# Altium project STM32F407_PLC_20260104.PrjPcb (part 1 of 2)
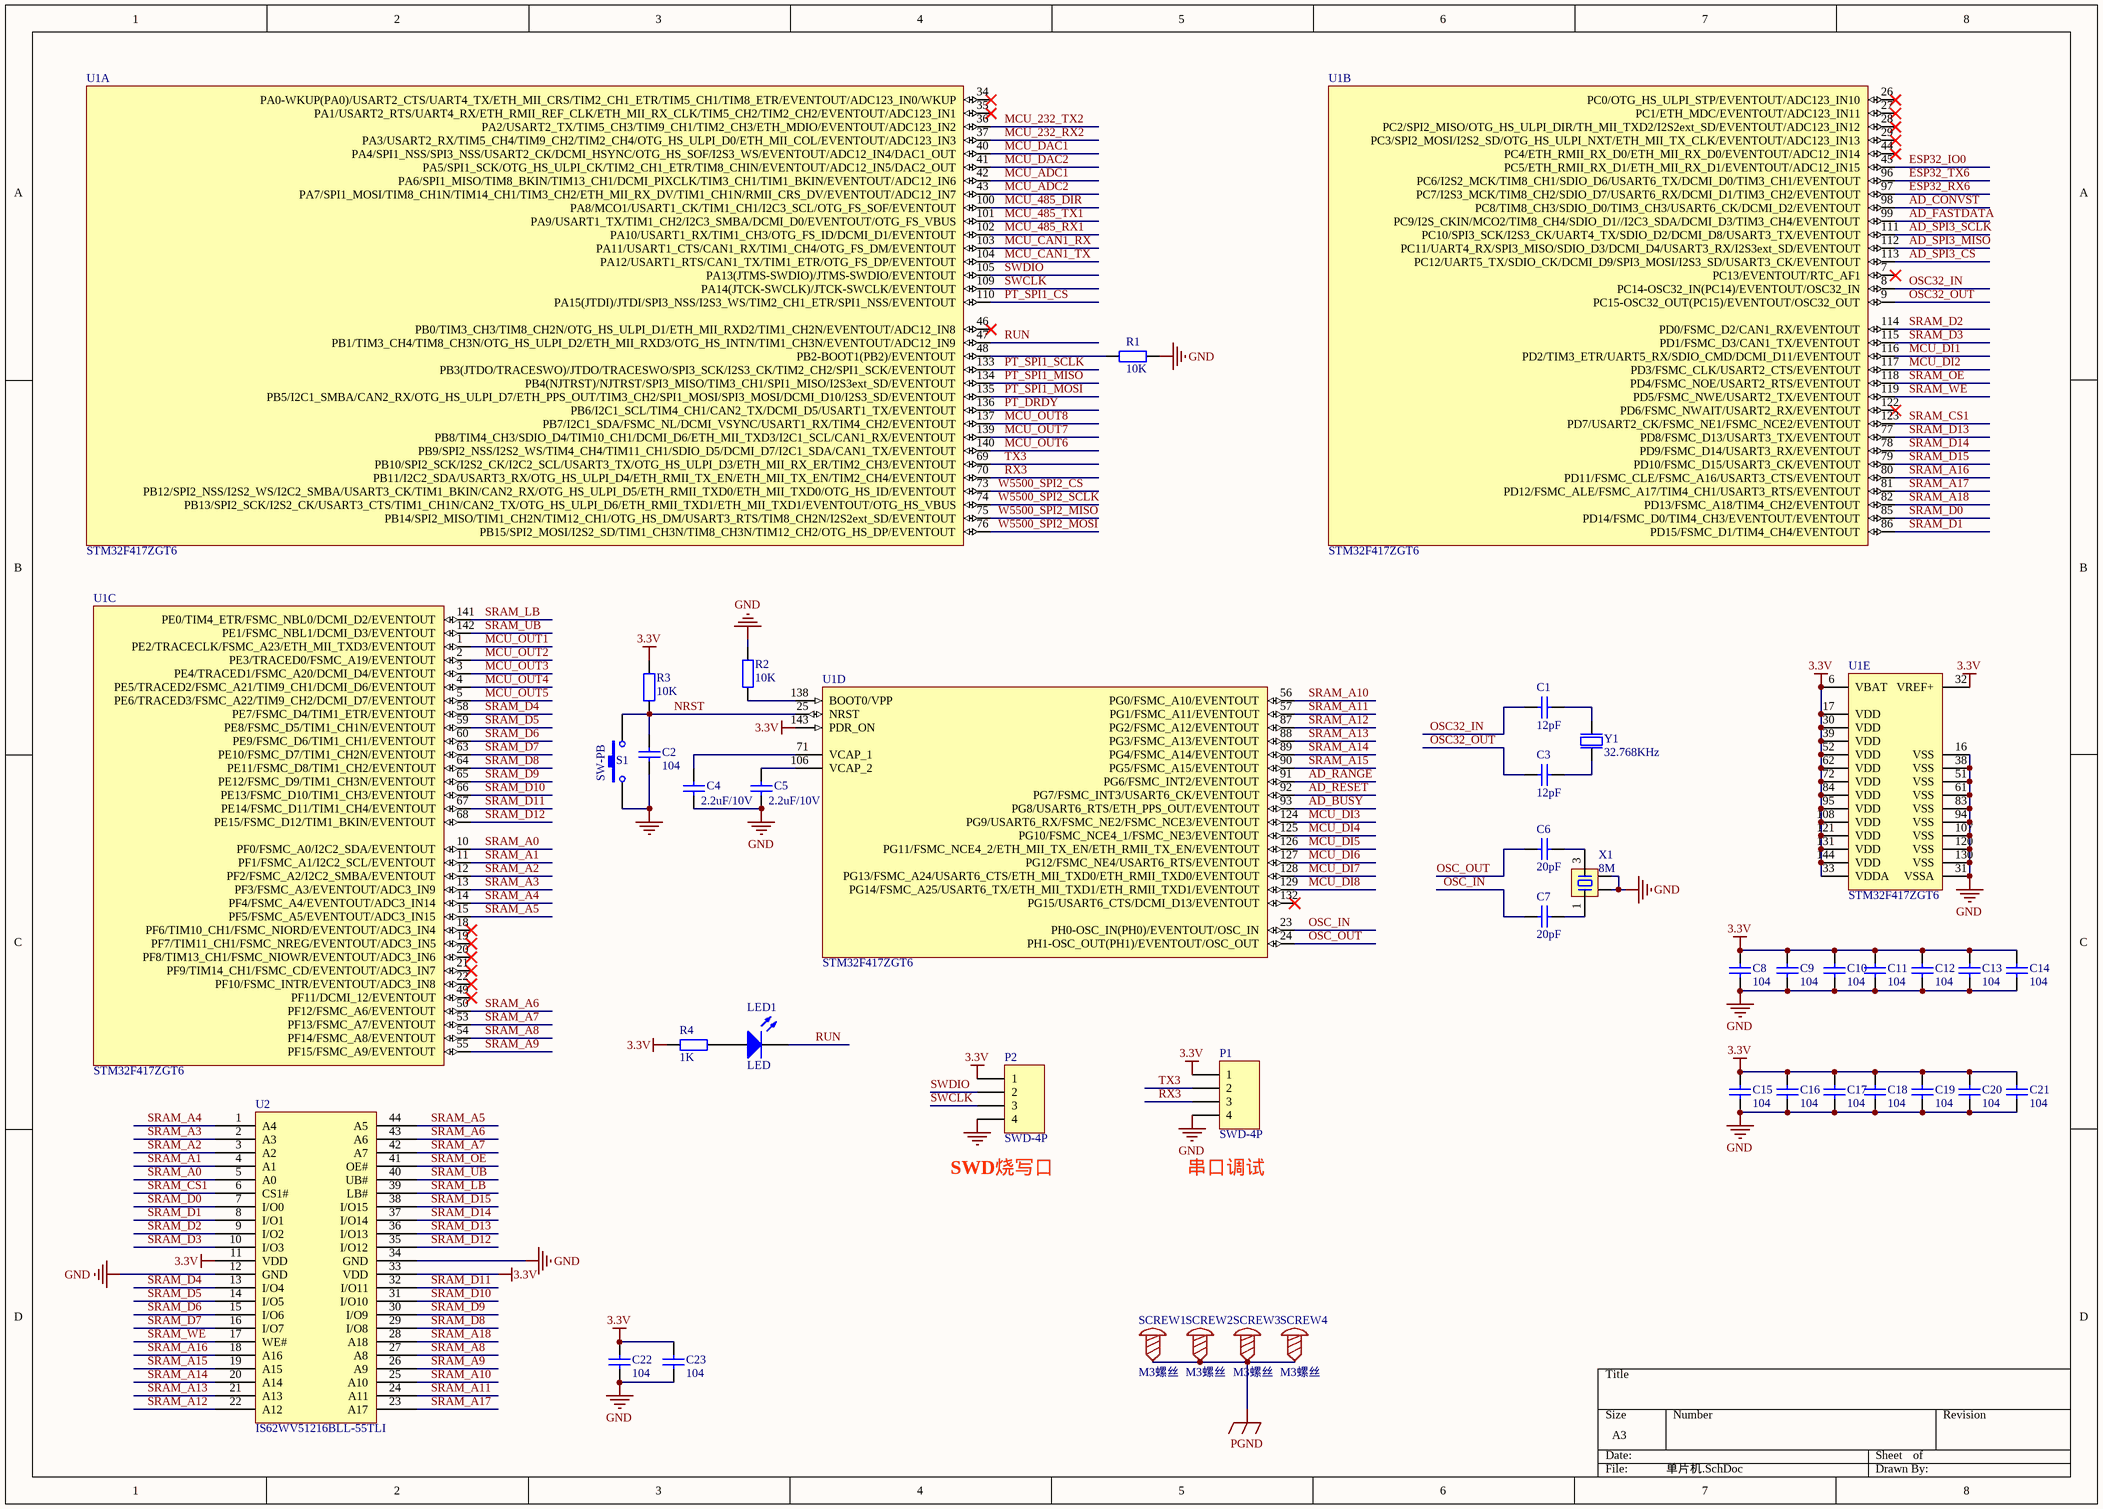
[diagram p0: 单片机.SchDoc]
8 sheets, 323 parts. Net scope: global (net labels, ports and power ports of the same name join across sheets).
Board file: STM32F407_PLC_20260104.PcbDoc
Sheets:
  单片机.SchDoc
  电源.SchDoc
  光耦开关量输入输出.SchDoc
  串口通信电路.SchDoc
  模拟量输入输出电路.SchDoc
  模拟量采集电路.SchDoc
  网络通信电路.SchDoc
  网表.SchDoc

## Sheet 单片机.SchDoc
size A3; SheetNumber: 1; SheetTotal: 7

### Parts
C1  12pF  [C 0603_L]
C2  104  [C 0603_L]
C3  12pF  [C 0603_L]
C4  2.2uF/10V  [C 0603_L]
C5  2.2uF/10V  [C 0603_L]
C6  20pF  [C 0603_L]
C7  20pF  [C 0603_L]
C8  104  [C 0603_L]
C9  104  [C 0603_L]
C10  104  [C 0603_L]
C11  104  [C 0603_L]
C12  104  [C 0603_L]
C13  104  [C 0603_L]
C14  104  [C 0603_L]
C15  104  [C 0603_L]
C16  104  [C 0603_L]
C17  104  [C 0603_L]
C18  104  [C 0603_L]
C19  104  [C 0603_L]
C20  104  [C 0603_L]
C21  104  [C 0603_L]
C22  104  [C 0603_L]
C23  104  [C 0603_L]
LED1  LED  [LED 0603R]
P1  SWD-4P  [DB-1X4]
P2  SWD-4P  [DB-1X4]
R1  10K  [R 0603_L]
R2  10K  [R 0603_L]
R3  10K  [R 0603_L]
R4  1K  [R 0603_L]
S1  SW-PB  [轻触按键3*4]
SCREW1  M3螺丝  [螺丝孔]
SCREW2  M3螺丝  [螺丝孔]
SCREW3  M3螺丝  [螺丝孔]
SCREW4  M3螺丝  [螺丝孔]
U1  STM32F417ZGT6  [LQFP144 20X20_M]  (parts A,B,C,D,E of 5)
U2  IS62WV51216BLL-55TLI  [TSOP-44_L18.4-W10.2-P0.80-LS11.8-BL]
X1  8M  [OSC 3225-4P]
Y1  32.768KHz  [OSC 3215-2P]

### Nets
3.3V: C8.2 C9.2 C10.2 C11.2 C12.2 C13.2 C14.2 C15.2 C16.2 C17.2 C18.2 C19.2 C20.2 C21.2 C22.2 C23.2 P1.1 P2.1 R3.2 R4.1 U1.6(VBAT) U1.17(VDD) U1.30(VDD) U1.32(VREF+) U1.33(VDDA) U1.39(VDD) U1.52(VDD) U1.62(VDD) U1.72(VDD) U1.84(VDD) U1.95(VDD) U1.108(VDD) U1.121(VDD) U1.131(VDD) U1.143(PDR_ON) U1.144(VDD) U2.11(VDD) U2.33(VDD)
GND: C2.1 C4.2 C5.2 C8.1 C9.1 C10.1 C11.1 C12.1 C13.1 C14.1 C15.1 C16.1 C17.1 C18.1 C19.1 C20.1 C21.1 C22.1 C23.1 P1.4 P2.4 R1.1 R2.2 S1.1 U1.16(VSS) U1.31(VSSA) U1.38(VSS) U1.51(VSS) U1.61(VSS) U1.83(VSS) U1.94(VSS) U1.107(VSS) U1.120(VSS) U1.130(VSS) U2.12(GND) U2.34(GND) X1.2 X1.4
PGND: SCREW1.1 SCREW2.1 SCREW3.1 SCREW4.1
AD_BUSY: U1.93(PG8/USART6_RTS/ETH_PPS_OUT/EVENTOUT)
AD_CONVST: U1.98(PC8/TIM8_CH3/SDIO_D0/TIM3_CH3/USART6_CK/DCMI_D2/EVENTOUT)
AD_FASTDATA: U1.99(PC9/I2S_CKIN/MCO2/TIM8_CH4/SDIO_D1//I2C3_SDA/DCMI_D3/TIM3_CH4/EVENTOUT)
AD_RANGE: U1.91(PG6/FSMC_INT2/EVENTOUT)
AD_RESET: U1.92(PG7/FSMC_INT3/USART6_CK/EVENTOUT)
AD_SPI3_CS: U1.113(PC12/UART5_TX/SDIO_CK/DCMI_D9/SPI3_MOSI/I2S3_SD/USART3_CK/EVENTOUT)
AD_SPI3_MISO: U1.112(PC11/UART4_RX/SPI3_MISO/SDIO_D3/DCMI_D4/USART3_RX/I2S3ext_SD/EVENTOUT)
AD_SPI3_SCLK: U1.111(PC10/SPI3_SCK/I2S3_CK/UART4_TX/SDIO_D2/DCMI_D8/USART3_TX/EVENTOUT)
ESP32_IO0: U1.45(PC5/ETH_RMII_RX_D1/ETH_MII_RX_D1/EVENTOUT/ADC12_IN15)
ESP32_RX6: U1.97(PC7/I2S3_MCK/TIM8_CH2/SDIO_D7/USART6_RX/DCMI_D1/TIM3_CH2/EVENTOUT)
ESP32_TX6: U1.96(PC6/I2S2_MCK/TIM8_CH1/SDIO_D6/USART6_TX/DCMI_D0/TIM3_CH1/EVENTOUT)
MCU_232_RX2: U1.37(PA3/USART2_RX/TIM5_CH4/TIM9_CH2/TIM2_CH4/OTG_HS_ULPI_D0/ETH_MII_COL/EVENTOUT/ADC123_IN3)
MCU_232_TX2: U1.36(PA2/USART2_TX/TIM5_CH3/TIM9_CH1/TIM2_CH3/ETH_MDIO/EVENTOUT/ADC123_IN2)
MCU_485_DIR: U1.100(PA8/MCO1/USART1_CK/TIM1_CH1/I2C3_SCL/OTG_FS_SOF/EVENTOUT)
MCU_485_RX1: U1.102(PA10/USART1_RX/TIM1_CH3/OTG_FS_ID/DCMI_D1/EVENTOUT)
MCU_485_TX1: U1.101(PA9/USART1_TX/TIM1_CH2/I2C3_SMBA/DCMI_D0/EVENTOUT/OTG_FS_VBUS)
MCU_ADC1: U1.42(PA6/SPI1_MISO/TIM8_BKIN/TIM13_CH1/DCMI_PIXCLK/TIM3_CH1/TIM1_BKIN/EVENTOUT/ADC12_IN6)
MCU_ADC2: U1.43(PA7/SPI1_MOSI/TIM8_CH1N/TIM14_CH1/TIM3_CH2/ETH_MII_RX_DV/TIM1_CH1N/RMII_CRS_DV/EVENTOUT/ADC12_IN7)
MCU_CAN1_RX: U1.103(PA11/USART1_CTS/CAN1_RX/TIM1_CH4/OTG_FS_DM/EVENTOUT)
MCU_CAN1_TX: U1.104(PA12/USART1_RTS/CAN1_TX/TIM1_ETR/OTG_FS_DP/EVENTOUT)
MCU_DAC1: U1.40(PA4/SPI1_NSS/SPI3_NSS/USART2_CK/DCMI_HSYNC/OTG_HS_SOF/I2S3_WS/EVENTOUT/ADC12_IN4/DAC1_OUT)
MCU_DAC2: U1.41(PA5/SPI1_SCK/OTG_HS_ULPI_CK/TIM2_CH1_ETR/TIM8_CHIN/EVENTOUT/ADC12_IN5/DAC2_OUT)
MCU_DI1: U1.116(PD2/TIM3_ETR/UART5_RX/SDIO_CMD/DCMI_D11/EVENTOUT)
MCU_DI2: U1.117(PD3/FSMC_CLK/USART2_CTS/EVENTOUT)
MCU_DI3: U1.124(PG9/USART6_RX/FSMC_NE2/FSMC_NCE3/EVENTOUT)
MCU_DI4: U1.125(PG10/FSMC_NCE4_1/FSMC_NE3/EVENTOUT)
MCU_DI5: U1.126(PG11/FSMC_NCE4_2/ETH_MII_TX_EN/ETH_RMII_TX_EN/EVENTOUT)
MCU_DI6: U1.127(PG12/FSMC_NE4/USART6_RTS/EVENTOUT)
MCU_DI7: U1.128(PG13/FSMC_A24/USART6_CTS/ETH_MII_TXD0/ETH_RMII_TXD0/EVENTOUT)
MCU_DI8: U1.129(PG14/FSMC_A25/USART6_TX/ETH_MII_TXD1/ETH_RMII_TXD1/EVENTOUT)
MCU_OUT1: U1.1(PE2/TRACECLK/FSMC_A23/ETH_MII_TXD3/EVENTOUT)
MCU_OUT2: U1.2(PE3/TRACED0/FSMC_A19/EVENTOUT)
MCU_OUT3: U1.3(PE4/TRACED1/FSMC_A20/DCMI_D4/EVENTOUT)
MCU_OUT4: U1.4(PE5/TRACED2/FSMC_A21/TIM9_CH1/DCMI_D6/EVENTOUT)
MCU_OUT5: U1.5(PE6/TRACED3/FSMC_A22/TIM9_CH2/DCMI_D7/EVENTOUT)
MCU_OUT6: U1.140(PB9/SPI2_NSS/I2S2_WS/TIM4_CH4/TIM11_CH1/SDIO_D5/DCMI_D7/I2C1_SDA/CAN1_TX/EVENTOUT)
MCU_OUT7: U1.139(PB8/TIM4_CH3/SDIO_D4/TIM10_CH1/DCMI_D6/ETH_MII_TXD3/I2C1_SCL/CAN1_RX/EVENTOUT)
MCU_OUT8: U1.137(PB7/I2C1_SDA/FSMC_NL/DCMI_VSYNC/USART1_RX/TIM4_CH2/EVENTOUT)
NRST: C2.2 R3.1 S1.2 U1.25(NRST)
OSC32_IN: C1.2 U1.8(PC14-OSC32_IN(PC14)/EVENTOUT/OSC32_IN)
OSC32_OUT: C3.2 U1.9(PC15-OSC32_OUT(PC15)/EVENTOUT/OSC32_OUT)
OSC_IN: C7.2 U1.23(PH0-OSC_IN(PH0)/EVENTOUT/OSC_IN)
OSC_OUT: C6.2 U1.24(PH1-OSC_OUT(PH1)/EVENTOUT/OSC_OUT)
PT_DRDY: U1.136(PB6/I2C1_SCL/TIM4_CH1/CAN2_TX/DCMI_D5/USART1_TX/EVENTOUT)
PT_SPI1_CS: U1.110(PA15(JTDI)/JTDI/SPI3_NSS/I2S3_WS/TIM2_CH1_ETR/SPI1_NSS/EVENTOUT)
PT_SPI1_MISO: U1.134(PB4(NJTRST)/NJTRST/SPI3_MISO/TIM3_CH1/SPI1_MISO/I2S3ext_SD/EVENTOUT)
PT_SPI1_MOSI: U1.135(PB5/I2C1_SMBA/CAN2_RX/OTG_HS_ULPI_D7/ETH_PPS_OUT/TIM3_CH2/SPI1_MOSI/SPI3_MOSI/DCMI_D10/I2S3_SD/EVENTOUT)
PT_SPI1_SCLK: U1.133(PB3(JTDO/TRACESWO)/JTDO/TRACESWO/SPI3_SCK/I2S3_CK/TIM2_CH2/SPI1_SCK/EVENTOUT)
RUN: LED1.2(K) U1.47(PB1/TIM3_CH4/TIM8_CH3N/OTG_HS_ULPI_D2/ETH_MII_RXD3/OTG_HS_INTN/TIM1_CH3N/EVENTOUT/ADC12_IN9)
RX3: P1.3 U1.70(PB11/I2C2_SDA/USART3_RX/OTG_HS_ULPI_D4/ETH_RMII_TX_EN/ETH_MII_TX_EN/TIM2_CH4/EVENTOUT)
SRAM_A0: U1.10(PF0/FSMC_A0/I2C2_SDA/EVENTOUT) U2.5(A0)
SRAM_A1: U1.11(PF1/FSMC_A1/I2C2_SCL/EVENTOUT) U2.4(A1)
SRAM_A2: U1.12(PF2/FSMC_A2/I2C2_SMBA/EVENTOUT) U2.3(A2)
SRAM_A3: U1.13(PF3/FSMC_A3/EVENTOUT/ADC3_IN9) U2.2(A3)
SRAM_A4: U1.14(PF4/FSMC_A4/EVENTOUT/ADC3_IN14) U2.1(A4)
SRAM_A5: U1.15(PF5/FSMC_A5/EVENTOUT/ADC3_IN15) U2.44(A5)
SRAM_A6: U1.50(PF12/FSMC_A6/EVENTOUT) U2.43(A6)
SRAM_A7: U1.53(PF13/FSMC_A7/EVENTOUT) U2.42(A7)
SRAM_A8: U1.54(PF14/FSMC_A8/EVENTOUT) U2.27(A8)
SRAM_A9: U1.55(PF15/FSMC_A9/EVENTOUT) U2.26(A9)
SRAM_A10: U1.56(PG0/FSMC_A10/EVENTOUT) U2.25(A10)
SRAM_A11: U1.57(PG1/FSMC_A11/EVENTOUT) U2.24(A11)
SRAM_A12: U1.87(PG2/FSMC_A12/EVENTOUT) U2.22(A12)
SRAM_A13: U1.88(PG3/FSMC_A13/EVENTOUT) U2.21(A13)
SRAM_A14: U1.89(PG4/FSMC_A14/EVENTOUT) U2.20(A14)
SRAM_A15: U1.90(PG5/FSMC_A15/EVENTOUT) U2.19(A15)
SRAM_A16: U1.80(PD11/FSMC_CLE/FSMC_A16/USART3_CTS/EVENTOUT) U2.18(A16)
SRAM_A17: U1.81(PD12/FSMC_ALE/FSMC_A17/TIM4_CH1/USART3_RTS/EVENTOUT) U2.23(A17)
SRAM_A18: U1.82(PD13/FSMC_A18/TIM4_CH2/EVENTOUT) U2.28(A18)
SRAM_CS1: U1.123(PD7/USART2_CK/FSMC_NE1/FSMC_NCE2/EVENTOUT) U2.6(CS1#)
SRAM_D0: U1.85(PD14/FSMC_D0/TIM4_CH3/EVENTOUT/EVENTOUT) U2.7(I/O0)
SRAM_D1: U1.86(PD15/FSMC_D1/TIM4_CH4/EVENTOUT) U2.8(I/O1)
SRAM_D2: U1.114(PD0/FSMC_D2/CAN1_RX/EVENTOUT) U2.9(I/O2)
SRAM_D3: U1.115(PD1/FSMC_D3/CAN1_TX/EVENTOUT) U2.10(I/O3)
SRAM_D4: U1.58(PE7/FSMC_D4/TIM1_ETR/EVENTOUT) U2.13(I/O4)
SRAM_D5: U1.59(PE8/FSMC_D5/TIM1_CH1N/EVENTOUT) U2.14(I/O5)
SRAM_D6: U1.60(PE9/FSMC_D6/TIM1_CH1/EVENTOUT) U2.15(I/O6)
SRAM_D7: U1.63(PE10/FSMC_D7/TIM1_CH2N/EVENTOUT) U2.16(I/O7)
SRAM_D8: U1.64(PE11/FSMC_D8/TIM1_CH2/EVENTOUT) U2.29(I/O8)
SRAM_D9: U1.65(PE12/FSMC_D9/TIM1_CH3N/EVENTOUT) U2.30(I/O9)
SRAM_D10: U1.66(PE13/FSMC_D10/TIM1_CH3/EVENTOUT) U2.31(I/O10)
SRAM_D11: U1.67(PE14/FSMC_D11/TIM1_CH4/EVENTOUT) U2.32(I/O11)
SRAM_D12: U1.68(PE15/FSMC_D12/TIM1_BKIN/EVENTOUT) U2.35(I/O12)
SRAM_D13: U1.77(PD8/FSMC_D13/USART3_TX/EVENTOUT) U2.36(I/O13)
SRAM_D14: U1.78(PD9/FSMC_D14/USART3_RX/EVENTOUT) U2.37(I/O14)
SRAM_D15: U1.79(PD10/FSMC_D15/USART3_CK/EVENTOUT) U2.38(I/O15)
SRAM_LB: U1.141(PE0/TIM4_ETR/FSMC_NBL0/DCMI_D2/EVENTOUT) U2.39(LB#)
SRAM_OE: U1.118(PD4/FSMC_NOE/USART2_RTS/EVENTOUT) U2.41(OE#)
SRAM_UB: U1.142(PE1/FSMC_NBL1/DCMI_D3/EVENTOUT) U2.40(UB#)
SRAM_WE: U1.119(PD5/FSMC_NWE/USART2_TX/EVENTOUT) U2.17(WE#)
SWCLK: P2.3 U1.109(PA14(JTCK-SWCLK)/JTCK-SWCLK/EVENTOUT)
SWDIO: P2.2 U1.105(PA13(JTMS-SWDIO)/JTMS-SWDIO/EVENTOUT)
TX3: P1.2 U1.69(PB10/SPI2_SCK/I2S2_CK/I2C2_SCL/USART3_TX/OTG_HS_ULPI_D3/ETH_MII_RX_ER/TIM2_CH3/EVENTOUT)
W5500_SPI2_CS: U1.73(PB12/SPI2_NSS/I2S2_WS/I2C2_SMBA/USART3_CK/TIM1_BKIN/CAN2_RX/OTG_HS_ULPI_D5/ETH_RMII_TXD0/ETH_MII_TXD0/OTG_HS_ID/EVENTOUT)
W5500_SPI2_MISO: U1.75(PB14/SPI2_MISO/TIM1_CH2N/TIM12_CH1/OTG_HS_DM/USART3_RTS/TIM8_CH2N/I2S2ext_SD/EVENTOUT)
W5500_SPI2_MOSI: U1.76(PB15/SPI2_MOSI/I2S2_SD/TIM1_CH3N/TIM8_CH3N/TIM12_CH2/OTG_HS_DP/EVENTOUT)
W5500_SPI2_SCLK: U1.74(PB13/SPI2_SCK/I2S2_CK/USART3_CTS/TIM1_CH1N/CAN2_TX/OTG_HS_ULPI_D6/ETH_RMII_TXD1/ETH_MII_TXD1/EVENTOUT/OTG_HS_VBUS)
NetC1_1: C1.1 Y1.2(out)
NetC3_1: C3.1 Y1.1(inp)
NetC4_1: C4.1 U1.71(VCAP_1)
NetC5_1: C5.1 U1.106(VCAP_2)
NetC6_1: C6.1 X1.3
NetC7_1: C7.1 X1.1
NetLED1_1: LED1.1(A) R4.2
NetR1_2: R1.2 U1.48(PB2-BOOT1(PB2)/EVENTOUT)
NetR2_1: R2.1 U1.138(BOOT0/VPP)

Not connected (* = marked no-connect by the designer): U1 7(PC13/EVENTOUT/RTC_AF1)* 18(PF6/TIM10_CH1/FSMC_NIORD/EVENTOUT/ADC3_IN4)* 19(PF7/TIM11_CH1/FSMC_NREG/EVENTOUT/ADC3_IN5)* 20(PF8/TIM13_CH1/FSMC_NIOWR/EVENTOUT/ADC3_IN6)* 21(PF9/TIM14_CH1/FSMC_CD/EVENTOUT/ADC3_IN7)* 22(PF10/FSMC_INTR/EVENTOUT/ADC3_IN8)* 26(PC0/OTG_HS_ULPI_STP/EVENTOUT/ADC123_IN10)* 27(PC1/ETH_MDC/EVENTOUT/ADC123_IN11)* 28(PC2/SPI2_MISO/OTG_HS_ULPI_DIR/TH_MII_TXD2/I2S2ext_SD/EVENTOUT/ADC123_IN12)* 29(PC3/SPI2_MOSI/I2S2_SD/OTG_HS_ULPI_NXT/ETH_MII_TX_CLK/EVENTOUT/ADC123_IN13)* 34(PA0-WKUP(PA0)/USART2_CTS/UART4_TX/ETH_MII_CRS/TIM2_CH1_ETR/TIM5_CH1/TIM8_ETR/EVENTOUT/ADC123_IN0/WKUP)* 35(PA1/USART2_RTS/UART4_RX/ETH_RMII_REF_CLK/ETH_MII_RX_CLK/TIM5_CH2/TIM2_CH2/EVENTOUT/ADC123_IN1)* 44(PC4/ETH_RMII_RX_D0/ETH_MII_RX_D0/EVENTOUT/ADC12_IN14)* 46(PB0/TIM3_CH3/TIM8_CH2N/OTG_HS_ULPI_D1/ETH_MII_RXD2/TIM1_CH2N/EVENTOUT/ADC12_IN8)* 49(PF11/DCMI_12/EVENTOUT)* 122(PD6/FSMC_NWAIT/USART2_RX/EVENTOUT)* 132(PG15/USART6_CTS/DCMI_D13/EVENTOUT)*

### Notes on the sheet
- (near P2) SWD烧写口
- (near P1) 串口调试

### Library data of the parts
C1-C23 = Cap: 0603贴片电容; Published: 8-Jun-2000; LatestRevisionDate: 17-Jul-2002; LatestRevisionNote: Re-released for DXP Platform.; PackageReference: RAD-0.3; Publisher: Altium Limited; PackageDescription: Radial Cap, Thru-Hole; 2 Leads; 0.3 in Pin Spacing
LED1 = LED: 0603发光二极管; Published: 8-Jun-2000; LatestRevisionDate: 08-Jul-2005; LatestRevisionNote: Mech Layer 1 removed.; PackageReference: LED-0; Publisher: Altium Limited; PackageDescription: LED; 2 Leads
P1 P2 = 2.54排针-4P: LatestRevisionDate: 17-Jul-2002; LatestRevisionNote: Re-released for DXP Platform.; Publisher: Altium Limited
R1 R2 = Res: 0603贴片电阻; BOM名称: 贴片电阻; 版权归属: 源创客; 学习资源: www.ooocke.com
R3 R4 = Res: C0603贴片电阻; BOM名称: 贴片电阻; 版权归属: 源创客; 学习资源: www.ooocke.com
S1 = SW-PB: Switch; Published: 24-Mar-1999; LatestRevisionDate: 17-Jul-2002; LatestRevisionNote: Re-released for DXP Platform.; PackageReference: SPST-2; Publisher: Altium Limited; PackageDescription: Switch; 2 Leads
SCREW1-SCREW4 = M3螺丝: Convert to PCB: yes; Symbol: 螺丝孔; Device: M3螺丝; Add into BOM: yes; Supplier Footprint: 插件
U1 = STM32F417ZGT6: ARM Cortex-M4 32b MCU+FPU, 210DMIP, 1024 kB Flash, 192+4 kB RAM, Crypto, Camera, 114 I/Os, 144-pin LQFP, -40 to +85癈, Tray; Internal RAM: 192kB; Operating Frequency (Processor Speed): 168MHz; A/D Converter: 24x12-bit; D/A Converter: 2x12-bit; 16-bit Timers (IC/OC/PWM): 12x16-bit(24/24/30); 32-bit Timer (IC/OC/PWM): 2x32-bit (8/8/8); Other Timer Functions: 2xWDG, RTC, 24-bit down counter; Serial Interface: 3xSPI/2xI2S/2xI2C/3xUSART(IrDa, ISO7816)/3xUART/2xUSB OTG FS/HS, 2xCAN/Ethernet MAC10/100, SDIO; DatasheetVersion: rev2, Jan-2012; PackageVersion: 2012; PackageReference: TQFP144; PackageDescription: 144-Pin Low Profile Quad Flat Package, 20x20 mm Body, 0.5 mm Pitch; ComponentLink1Description: Manufacturer URL; ComponentLink1URL: http://www.st.com/; ComponentLink2Description: STM32F415/7 Datasheet; ComponentLink2URL: http://www.st.com/internet/com/TECHNICAL_RESOURCES/TECHNICAL_LITERATURE/DATASHEET/DM00035129.pdf; ComponentLink3Description: STM32F4 Web Page; ComponentLink3URL: http://www.st.com/internet/mcu/subclass/1521.jsp
U2 = IS62WV51216BLL-55TLI: Manufacturer: ISSI(美国芯成); Add into BOM: yes; Memory Size: 8Mbit; Voltage - Supply: 2.5V~3.6V; Access Time: 55ns; Supply Current (Icc): 30mA; Standby Current (Iq): 25uA; Symbol: IS62WV51216BLL-55TLI; Device: IS62WV51216BLL-55TLI; LCSC Part Name: 512K X 16 低电压超低功耗CMOS静态RAM; Supplier Part: C11315; Manufacturer Part: IS62WV51216BLL-55TLI; Supplier Footprint: TSOP-44-10.2mm; Datasheet: https://item.szlcsc.com/datasheet/IS62WV51216BLL-55TLI/11868.html; Supplier: LCSC; Convert to PCB: yes; Operating Temperature: -40℃~+85℃
X1 = XTAL-4P: 4脚无源晶振; 版权归属: 封装库来自淘宝卖家 ID：黄晶宝石; BOM名称: 4脚无源晶振; 学习资源: https://shop463601444.taobao.com
Y1 = XTAL_3215: Part Number: XTAL SMD 12MHz (3225); Manufacturer: TXC Corporation; Manufacturer Part Number: 7M-12.000MAAJ-T; 2nd source part number: 184-2056; Value: 12MHz; Note: XTAL SMD 12.000MHz; Artikkelnr Noca: 22019166; Datasheet: http://www.txccrystal.com/images/pdf/7m.pdf; Footprint: BT-XTAL_3225; LatestRevisionDate: 2010-08-31; Pin Count: 4; Publisher: Nordic Semiconductor; Published: 2010-08-31; Supplier: Digi-Key; Supplier part number: 887-1121-1-ND; 2nd source Supplier: Farnell

## Sheet 电源.SchDoc
size A4; SheetNumber: 2; SheetTotal: 6
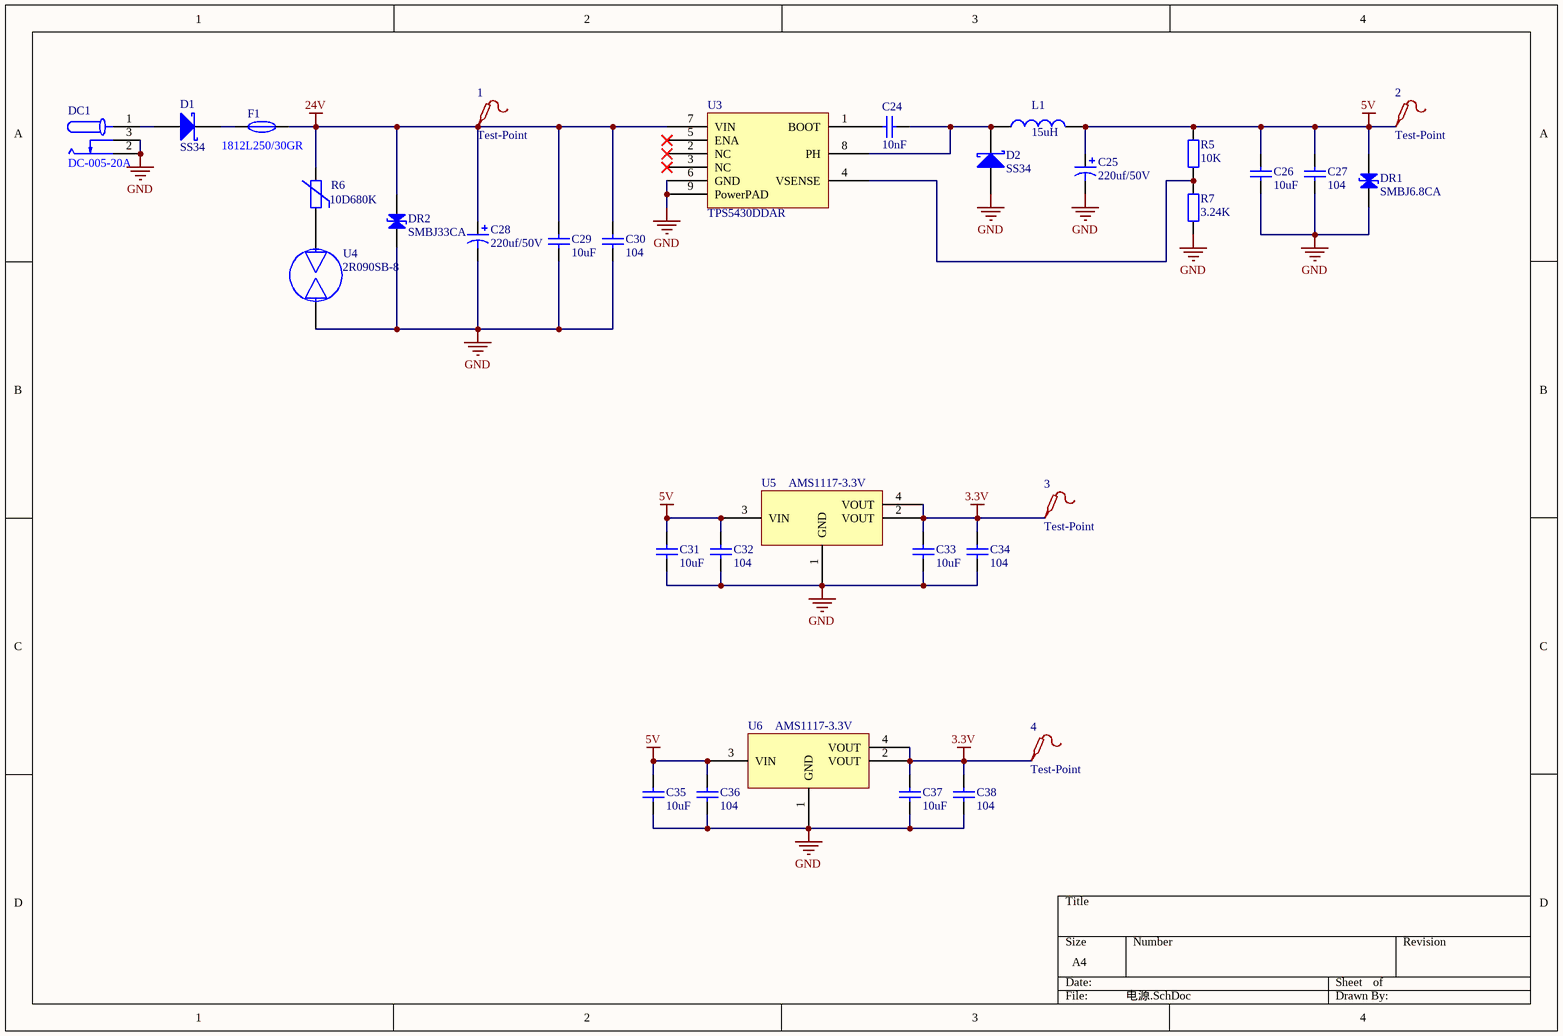
[diagram p1: 电源.SchDoc]

### Parts
1  Test-Point  [Test-Point-0.5mm]
2  Test-Point  [Test-Point-0.5mm]
3  Test-Point  [Test-Point-0.5mm]
4  Test-Point  [Test-Point-0.5mm]
C24  10nF  [C 0603_L]
C25  220uf/50V  [CAP 2.5*6.3*11.2 - GD]
C26  10uF  [C 0603_L]
C27  104  [C 0603_L]
C28  220uf/50V  [CAP 2.5*6.3*11.2 - GD]
C29  10uF  [C 0603_L]
C30  104  [C 0603_L]
C31  10uF  [C 0603_L]
C32  104  [C 0603_L]
C33  10uF  [C 0603_L]
C34  104  [C 0603_L]
C35  10uF  [C 0603_L]
C36  104  [C 0603_L]
C37  10uF  [C 0603_L]
C38  104  [C 0603_L]
D1  SS34  [SMA]
D2  SS34  [SMA]
DC1  DC-005-20A  [DC-005]
DR1  SMBJ6.8CA  [SMB]
DR2  SMBJ33CA  [SMB]
F1  1812L250/30GR  [F1812]
L1  15uH  [IND-SMD_L7.0-W6.6_FXL0630]
R5  10K  [R 0603_L]
R6  10D680K  [RES-TH_L12.0-W4.5-P7.50-D0.8-S1.60]
R7  3.24K  [R 0603_L]
U3  TPS5430DDAR  [tps5430]
U4  2R090SB-8  [DIO-DT-SMD_L8.0-W6.0]
U5  AMS1117-3.3V  [SOT-223-3_L6.5-W3.4-P2.30-LS7.0-BR]
U6  AMS1117-3.3V  [SOT-223-3_L6.5-W3.4-P2.30-LS7.0-BR]

### Nets
3.3V: 3.1 4.1 C33.2 C34.2 C37.2 C38.2 U5.2(VOUT) U5.4(VOUT) U6.2(VOUT) U6.4(VOUT)
5V: 2.1 C25.1 C26.2 C27.2 C31.2 C32.2 C35.2 C36.2 DR1.1(A) L1.2 R5.2 U5.3(VIN) U6.3(VIN)
24V: 1.1 C28.1 C29.2 C30.2 DR2.1(A) F1.2 R6.2 U3.7(VIN)
GND: C25.2 C26.1 C27.1 C28.2 C29.1 C30.1 C31.1 C32.1 C33.1 C34.1 C35.1 C36.1 C37.1 C38.1 D2.1(A) DC1.2 DC1.3 DR1.2(K) DR2.2(K) R7.1 U3.6(GND) U3.9(PowerPAD) U4.2 U5.1(GND) U6.1(GND)
NetC24_1: C24.1 D2.2(K) L1.1 U3.8(PH)
NetC24_2: C24.2 U3.1(BOOT)
NetD1_1: D1.1(A) DC1.1
NetD1_2: D1.2(K) F1.1
NetR5_1: R5.1 R7.2 U3.4(VSENSE)
NetR6_1: R6.1 U4.1

Not connected (* = marked no-connect by the designer): U3 2(NC)* 3(NC)* 5(ENA)*

### Library data of the parts
1-4 = Test-Point: Add into BOM: yes; Symbol: Test-Point; Device: Test-Point; Convert to PCB: yes
C24 C26 C27 C29-C38 = Cap: 0603贴片电容; Published: 8-Jun-2000; LatestRevisionDate: 17-Jul-2002; LatestRevisionNote: Re-released for DXP Platform.; PackageReference: RAD-0.3; Publisher: Altium Limited; PackageDescription: Radial Cap, Thru-Hole; 2 Leads; 0.3 in Pin Spacing
C25 C28 = Cap Pol1: Polarized Capacitor (Radial); Published: 8-Jun-2000; LatestRevisionDate: 17-Jul-2002; LatestRevisionNote: Re-released for DXP Platform.; PackageReference: RB7.6-15; Publisher: Altium Limited; PackageDescription: Polarized Capacitor (Radial); 2 Leads
D1 = SS34: SMA肖特基二极管; BOM名称: 肖特基二极管; 属性: 40V/3A; 封装库来自淘宝 ID：黄晶宝石: https://shop463601444.taobao.com
D2 = B340A: SMA肖特基二极管; BOM名称: 肖特基二极管; 属性: 40V/3A; 封装库来自淘宝 ID：黄晶宝石: https://shop463601444.taobao.com
DC1 = DC-005-20A: DC电源接口; Manufacturer: 韩国韩荣; Add into BOM: yes; Connector Type: DC电源插座; Inside Contact Diameter: 2mm; Outside Contact Diameter: 6.4mm; Current Rating: 500mA; Voltage Rating (Max): 30V; Symbol: DC-005-20A; Device: DC-005-20A; LCSC Part Name: DC电源插座 内径:2mm 外径:6.4mm; Supplier Part: C130239; Manufacturer Part: DC-005-20A; Supplier Footprint: 插件; Datasheet: https://item.szlcsc.com/datasheet/DC-005-20A/141526.html; Supplier: LCSC; Convert to PCB: yes; Mounting Type: 弯插; Operating Temperature: -25℃~+80℃
DR1 DR2 = TVS: DO-214AA，瞬态电压抑制二极管; 版权归属: 源创客; BOM名称: 瞬态电压抑制二极管; 学习资源: www.ooocke.com
F1 = 1812L250/30GR: 1812，自恢复保险丝; Manufacturer: LUTE(陆特); Add into BOM: yes; Voltage - Max: 30V; Current - Max: 40A; Hold Current: 2.5A; Trip Current: 5A; Power Dissipation: 1W; Resistance - Initial (Ri) (Min): 15mΩ; Resistance - Post Trip (R1) (Max): 90mΩ; Time to Trip(Max): 2.5s; Symbol: 1812L250/30GR; Device: 1812L250/30GR; LCSC Part Name: 30V 2.5A 1812自恢复保险丝; Supplier Part: C52748011; Manufacturer Part: 1812L250/30GR; Supplier Footprint: 1812; JLCPCB Part Class: 扩展库; Datasheet: https://item.szlcsc.com/datasheet/1812L250%252F30GR/55639015.html; Supplier: LCSC; Convert to PCB: yes; Operating Temperature: -40℃~+85℃; Length: 4.73mm; Width: 3.41mm; Height: 1.5mm
L1 = L: 15uH小功率贴片电感; 版权归属: 源创客; BOM名称: 小功率贴片电感; 学习资源: www.ooocke.com
R5 R7 = Res: C0603贴片电阻; BOM名称: 贴片电阻; 版权归属: 源创客; 学习资源: www.ooocke.com
R6 = R_VDR: 压敏电阻; 版权归属: 源创客; BOM名称: 压敏电阻; 学习资源: www.ooocke.com
U3 = TPS5430DDAR: DC-DC，SOIC-8-EP; Manufacturer: TI(德州仪器); Add into BOM: yes; Function: 降压型; Output Type: 可调; Input Voltage: 5.5V~36V; Output Voltage: 1.221V~32.04V; Output Current: 3A; Switching Frequency: 500kHz; Synchronous Rectification: 否; Number of Outputs: 1; Topology: 降压式; Switch tube (built-in/external): 内置; Symbol: TPS5430DDAR; Device: TPS5430DDAR; LCSC Part Name: 宽输入范围、3A输出电流的降压转换器; Supplier Part: C9864; Manufacturer Part: TPS5430DDAR; Supplier Footprint: SOIC-8-EP; JLCPCB Part Class: 基础库; Datasheet: https://www.ti.com/cn/lit/gpn/tps5430; Supplier: LCSC; Convert to PCB: yes; Operating Temperature: -40℃~+125℃@(TJ); Name: TPS5430DDAR
U4 = 2R090SB-8_C485316: 气体放电管，90V、10kA; Manufacturer: RUILON(瑞隆源); Add into BOM: yes; Number of Poles: 2; Voltage - DC Spark Over (Nom): 90V; Tolerance: ±20%; Impulse Discharge Current: 10kA; inter-electrode capacitance: 1.5pF; Symbol: 2R090SB-8_C485316; Device: 2R090SB-8_C485316; LCSC Part Name: 蓝色 90V 10kA 2端 贴片GDT; Supplier Part: C485316; Manufacturer Part: 2R090SB-8; Supplier Footprint: SMD,8x6mm; JLCPCB Part Class: 扩展库; Datasheet: https://item.szlcsc.com/datasheet/2R090SB-8/493582.html; Supplier: LCSC; Convert to PCB: yes
U5 U6 = AMS1117-3.3V: 线性稳压器

## Sheet 光耦开关量输入输出.SchDoc
size A3; SheetNumber: 3; SheetTotal: 6
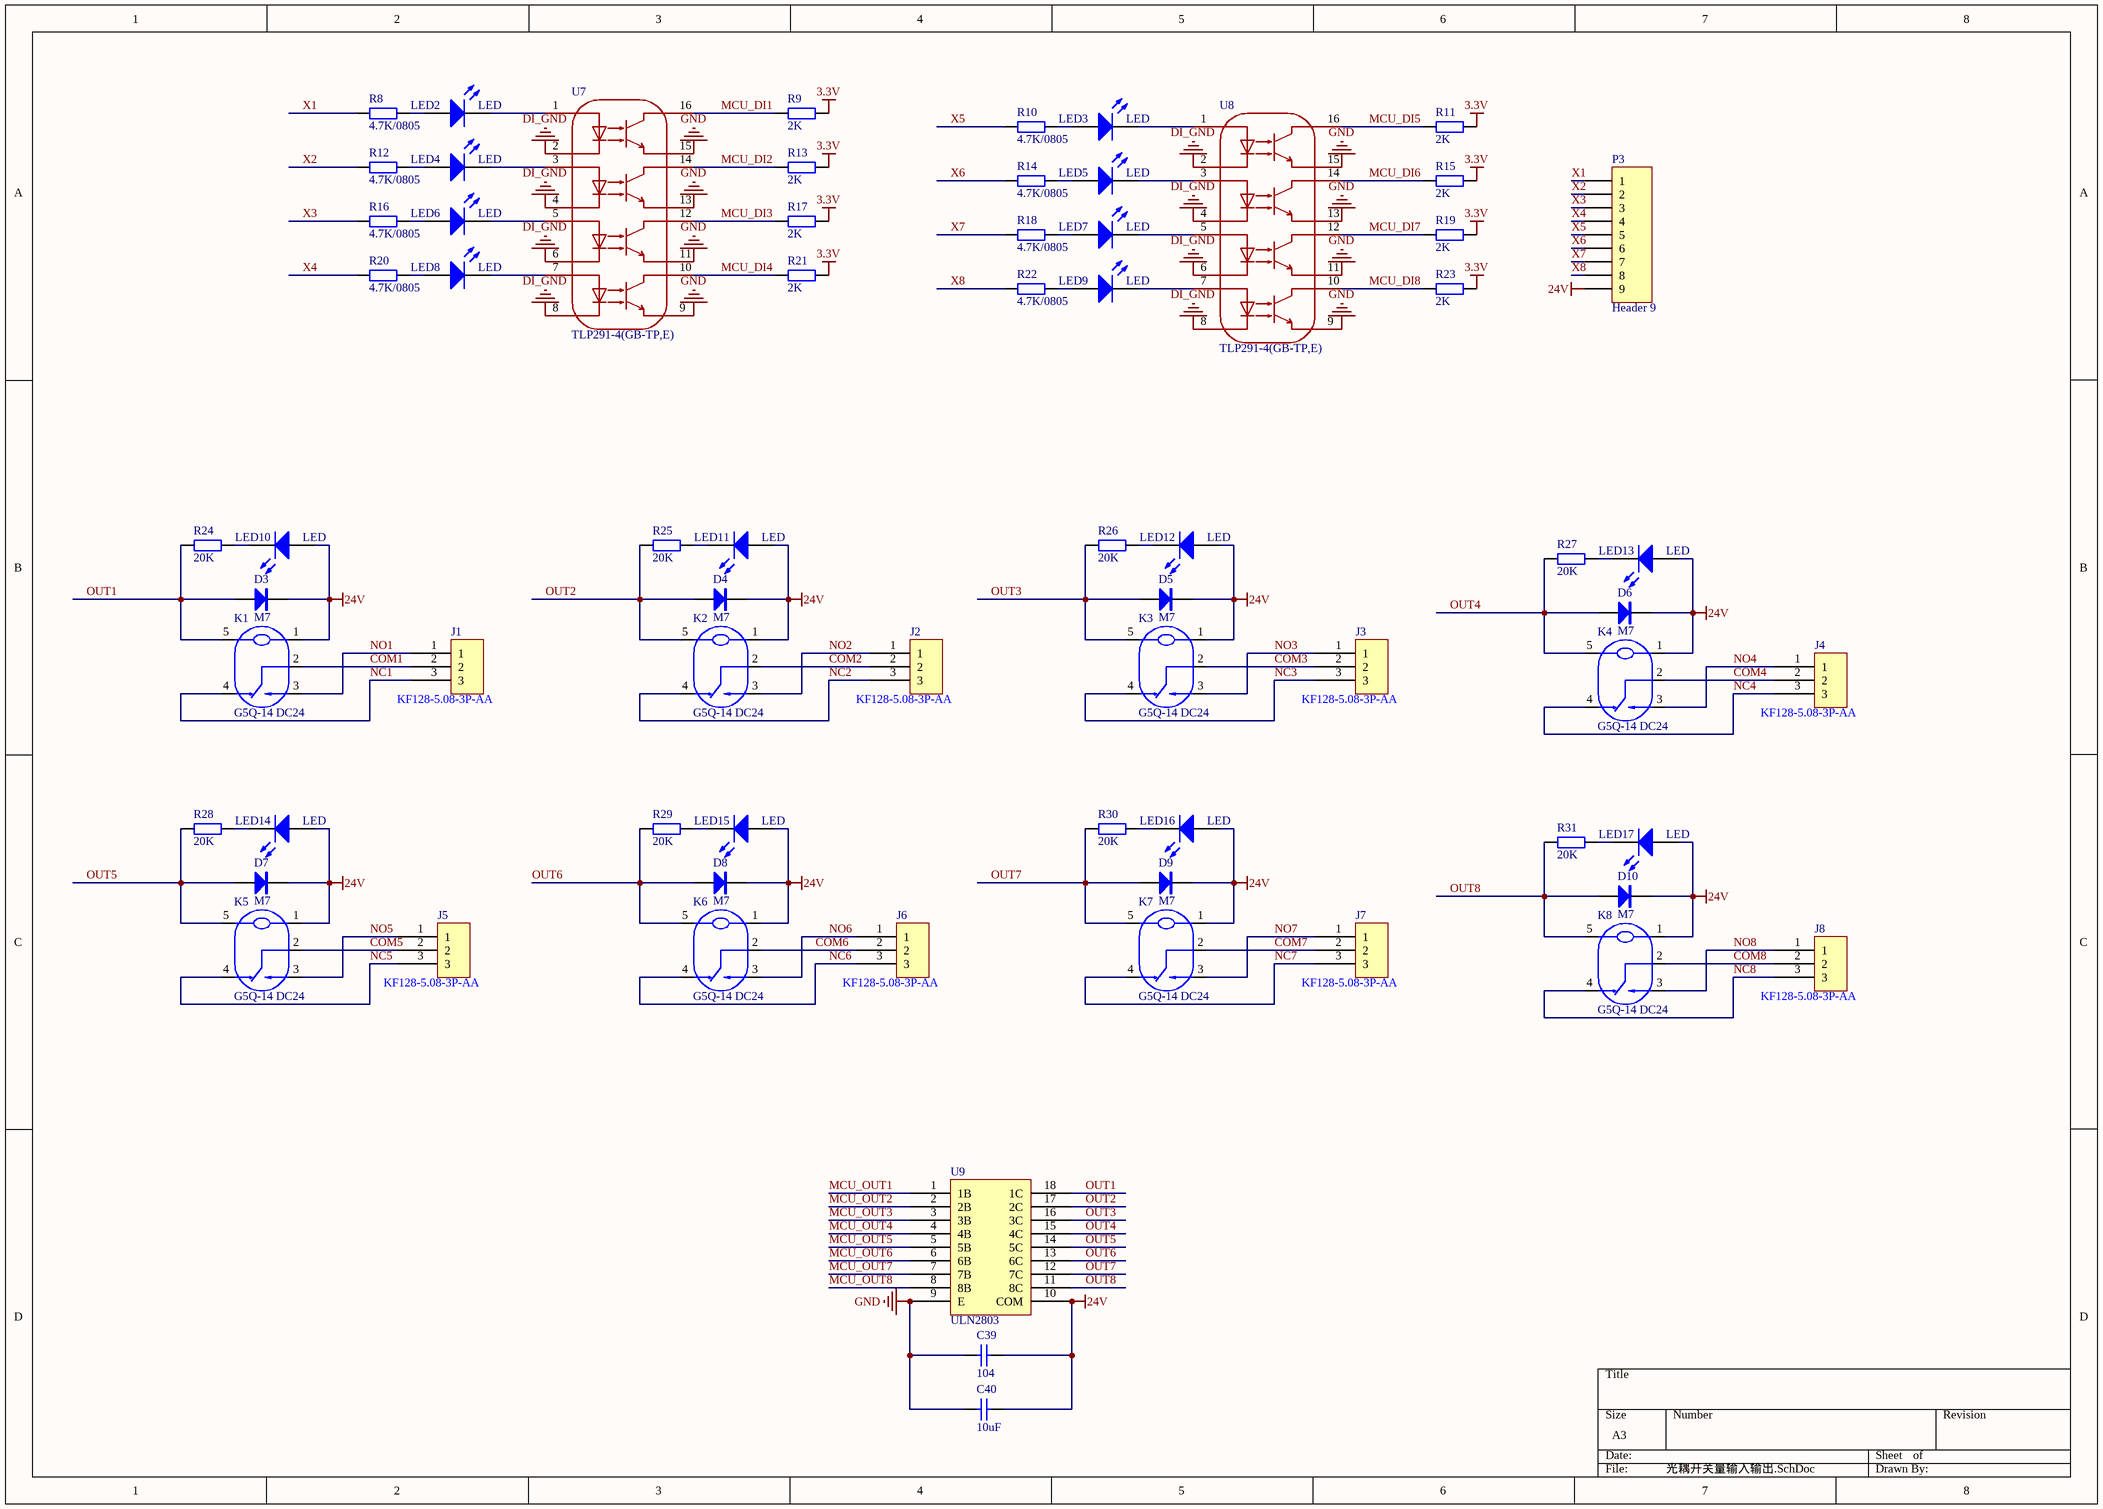
[diagram p2: 光耦开关量输入输出.SchDoc]

### Parts
C39  104  [C 0603_L]
C40  10uF  [C 0603_L]
D3  M7  [SMA]
D4  M7  [SMA]
D5  M7  [SMA]
D6  M7  [SMA]
D7  M7  [SMA]
D8  M7  [SMA]
D9  M7  [SMA]
D10  M7  [SMA]
J1  KF128-5.08-3P-AA  [KF128-5.08-3P]
J2  KF128-5.08-3P-AA  [KF128-5.08-3P]
J3  KF128-5.08-3P-AA  [KF128-5.08-3P]
J4  KF128-5.08-3P-AA  [KF128-5.08-3P]
J5  KF128-5.08-3P-AA  [KF128-5.08-3P]
J6  KF128-5.08-3P-AA  [KF128-5.08-3P]
J7  KF128-5.08-3P-AA  [KF128-5.08-3P]
J8  KF128-5.08-3P-AA  [KF128-5.08-3P]
K1  G5Q-14 DC24  [RELAY-TH_G5Q-14-DCXX]
K2  G5Q-14 DC24  [RELAY-TH_G5Q-14-DCXX]
K3  G5Q-14 DC24  [RELAY-TH_G5Q-14-DCXX]
K4  G5Q-14 DC24  [RELAY-TH_G5Q-14-DCXX]
K5  G5Q-14 DC24  [RELAY-TH_G5Q-14-DCXX]
K6  G5Q-14 DC24  [RELAY-TH_G5Q-14-DCXX]
K7  G5Q-14 DC24  [RELAY-TH_G5Q-14-DCXX]
K8  G5Q-14 DC24  [RELAY-TH_G5Q-14-DCXX]
LED2  LED  [LED 0603R]
LED3  LED  [LED 0603R]
LED4  LED  [LED 0603R]
LED5  LED  [LED 0603R]
LED6  LED  [LED 0603R]
LED7  LED  [LED 0603R]
LED8  LED  [LED 0603R]
LED9  LED  [LED 0603R]
LED10  LED  [LED 0603R]
LED11  LED  [LED 0603R]
LED12  LED  [LED 0603R]
LED13  LED  [LED 0603R]
LED14  LED  [LED 0603R]
LED15  LED  [LED 0603R]
LED16  LED  [LED 0603R]
LED17  LED  [LED 0603R]
P3  Header 9  [KF128-5.08-9P]
R8  4.7K/0805  [R0805_L]
R9  2K  [R 0603_L]
R10  4.7K/0805  [R0805_L]
R11  2K  [R 0603_L]
R12  4.7K/0805  [R0805_L]
R13  2K  [R 0603_L]
R14  4.7K/0805  [R0805_L]
R15  2K  [R 0603_L]
R16  4.7K/0805  [R0805_L]
R17  2K  [R 0603_L]
R18  4.7K/0805  [R0805_L]
R19  2K  [R 0603_L]
R20  4.7K/0805  [R0805_L]
R21  2K  [R 0603_L]
R22  4.7K/0805  [R0805_L]
R23  2K  [R 0603_L]
R24  20K  [R 0603_L]
R25  20K  [R 0603_L]
R26  20K  [R 0603_L]
R27  20K  [R 0603_L]
R28  20K  [R 0603_L]
R29  20K  [R 0603_L]
R30  20K  [R 0603_L]
R31  20K  [R 0603_L]
U7  TLP291-4(GB-TP,E)  [SOP-16_L10.3-W4.4-P1.27-LS7.0-BL]
U8  TLP291-4(GB-TP,E)  [SOP-16_L10.3-W4.4-P1.27-LS7.0-BL]
U9  ULN2803  [SOP-18_L11.6-W7.5-P1.27-LS10.3-BL]

### Nets
3.3V: R9.1 R11.1 R13.1 R15.1 R17.1 R19.1 R21.1 R23.1
24V: C39.1 C40.1 D3.2(K) D4.2(K) D5.2(K) D6.2(K) D7.2(K) D8.2(K) D9.2(K) D10.2(K) K1.1 K2.1 K3.1 K4.1 K5.1 K6.1 K7.1 K8.1 LED10.1(A) LED11.1(A) LED12.1(A) LED13.1(A) LED14.1(A) LED15.1(A) LED16.1(A) LED17.1(A) P3.9 U9.10(COM)
DI_GND: U7.2 U7.4 U7.6 U7.8 U8.2 U8.4 U8.6 U8.8
GND: C39.2 C40.2 U7.9 U7.11 U7.13 U7.15 U8.9 U8.11 U8.13 U8.15 U9.9(E)
COM1: J1.2 K1.2
COM2: J2.2 K2.2
COM3: J3.2 K3.2
COM4: J4.2 K4.2
COM5: J5.2 K5.2
COM6: J6.2 K6.2
COM7: J7.2 K7.2
COM8: J8.2 K8.2
MCU_DI1: R9.2 U7.16
MCU_DI2: R13.2 U7.14
MCU_DI3: R17.2 U7.12
MCU_DI4: R21.2 U7.10
MCU_DI5: R11.2 U8.16
MCU_DI6: R15.2 U8.14
MCU_DI7: R19.2 U8.12
MCU_DI8: R23.2 U8.10
MCU_OUT1: U9.1(1B)
MCU_OUT2: U9.2(2B)
MCU_OUT3: U9.3(3B)
MCU_OUT4: U9.4(4B)
MCU_OUT5: U9.5(5B)
MCU_OUT6: U9.6(6B)
MCU_OUT7: U9.7(7B)
MCU_OUT8: U9.8(8B)
NC1: J1.3 K1.4
NC2: J2.3 K2.4
NC3: J3.3 K3.4
NC4: J4.3 K4.4
NC5: J5.3 K5.4
NC6: J6.3 K6.4
NC7: J7.3 K7.4
NC8: J8.3 K8.4
NO1: J1.1 K1.3
NO2: J2.1 K2.3
NO3: J3.1 K3.3
NO4: J4.1 K4.3
NO5: J5.1 K5.3
NO6: J6.1 K6.3
NO7: J7.1 K7.3
NO8: J8.1 K8.3
OUT1: D3.1(A) K1.5 R24.2 U9.18(1C)
OUT2: D4.1(A) K2.5 R25.2 U9.17(2C)
OUT3: D5.1(A) K3.5 R26.2 U9.16(3C)
OUT4: D6.1(A) K4.5 R27.2 U9.15(4C)
OUT5: D7.1(A) K5.5 R28.2 U9.14(5C)
OUT6: D8.1(A) K6.5 R29.2 U9.13(6C)
OUT7: D9.1(A) K7.5 R30.2 U9.12(7C)
OUT8: D10.1(A) K8.5 R31.2 U9.11(8C)
X1: P3.1 R8.1
X2: P3.2 R12.1
X3: P3.3 R16.1
X4: P3.4 R20.1
X5: P3.5 R10.1
X6: P3.6 R14.1
X7: P3.7 R18.1
X8: P3.8 R22.1
NetLED2_1: LED2.1(A) R8.2
NetLED2_2: LED2.2(K) U7.1
NetLED3_1: LED3.1(A) R10.2
NetLED3_2: LED3.2(K) U8.1
NetLED4_1: LED4.1(A) R12.2
NetLED4_2: LED4.2(K) U7.3
NetLED5_1: LED5.1(A) R14.2
NetLED5_2: LED5.2(K) U8.3
NetLED6_1: LED6.1(A) R16.2
NetLED6_2: LED6.2(K) U7.5
NetLED7_1: LED7.1(A) R18.2
NetLED7_2: LED7.2(K) U8.5
NetLED8_1: LED8.1(A) R20.2
NetLED8_2: LED8.2(K) U7.7
NetLED9_1: LED9.1(A) R22.2
NetLED9_2: LED9.2(K) U8.7
NetLED10_2: LED10.2(K) R24.1
NetLED11_2: LED11.2(K) R25.1
NetLED12_2: LED12.2(K) R26.1
NetLED13_2: LED13.2(K) R27.1
NetLED14_2: LED14.2(K) R28.1
NetLED15_2: LED15.2(K) R29.1
NetLED16_2: LED16.2(K) R30.1
NetLED17_2: LED17.2(K) R31.1

### Library data of the parts
C39 C40 = Cap: 0603贴片电容; Published: 8-Jun-2000; LatestRevisionDate: 17-Jul-2002; LatestRevisionNote: Re-released for DXP Platform.; PackageReference: RAD-0.3; Publisher: Altium Limited; PackageDescription: Radial Cap, Thru-Hole; 2 Leads; 0.3 in Pin Spacing
D3-D10 = M7: 整流二极管; 淘宝ID: 封装库来自淘宝 ID：黄晶宝石; 封装库来自淘宝卖家 ID：黄晶宝石: 其他店铺购入均为盗版，不享受售后技术支持服务，请立即申请退款; BOM名称: 整流二极管; 联系售后，技术支持: https://shop463601444.taobao.com
J1-J8 = KF128-5.08-3P-AA: KF128-5.08-3P-AA端座; Manufacturer: KEFA(科发); Add into BOM: yes; Structure: 1x3P; Pitch: 5.08mm; Current Rating (Max): 24A; Voltage Rating (Max): 250V; Wire Gauge - AWG: 12~22; Wire Gauge - mm2: 2.5; Number of PINs Per Row: 3; Symbol: KF128-5.08-3P; Device: KF128-5.08-3P-AA; LCSC Part Name: 5.08mm 1x3P 排数:1 每排P数:3 直插; Supplier Part: C474953; Manufacturer Part: KF128-5.08-3P-AA; Supplier Footprint: 插件,P=5.08mm; JLCPCB Part Class: 扩展库; Datasheet: https://atta.szlcsc.com/upload/public/pdf/source/20230317/DADFED05827EAD48C1D5B8C3D4CF88F4.pdf; Supplier: LCSC; Convert to PCB: yes; Color: 绿色; Mounting Style: 直插; Number of Pins: 3P; Number of Rows: 1; Operating Temperature Range: -40℃~+105℃
K1-K8 = G5Q-14 DC24: 欧姆龙24V继电器，单刀双掷; Manufacturer: OMRON(欧姆龙); Symbol: G5Q-14-DC24; Add into BOM: yes; Coil Voltage: 24V; Contact Form: 一组转换:1C(单刀双掷-转换); Contact Rating: 10A@250VAC；3A@30VDC；5A@30VDC；3A@250VAC; Switching Voltage(Max): 277V@AC；30V@DC; Coil Rated Power: 400mW; Coil Resistance: 1.44kΩ; Contact Resistance: 100mΩ; Operate Time: 10ms; Release Time: 5ms; Device: G5Q-14 DC24; LCSC Part Name: 24V 一组转换:1C(单刀双掷-转换); Supplier Part: C397242; Manufacturer Part: G5Q-14 DC24; Supplier Footprint: 插件,20x10mm; JLCPCB Part Class: 扩展库; Datasheet: https://item.szlcsc.com/datasheet/G5Q-14%2520DC24/378779.html; Supplier: LCSC; Convert to PCB: yes; Number of Pins: -; Contact Material: 银合金(无镉); Switching Current(Max): -; Coil Type: -; Operating Temperature: -40℃~+105℃
LED2-LED17 = LED: 0603发光二极管; Published: 8-Jun-2000; LatestRevisionDate: 08-Jul-2005; LatestRevisionNote: Mech Layer 1 removed.; PackageReference: LED-0; Publisher: Altium Limited; PackageDescription: LED; 2 Leads
P3 = Header 9: Header, 9-Pin; LatestRevisionDate: 17-Jul-2002; LatestRevisionNote: Re-released for DXP Platform.; Publisher: Altium Limited
R8 R10 R12 R14 R16 R18 R20 R22 = Res_15: R0805贴片电阻; BOM名称: 贴片电阻; 版权归属: 源创客; 学习资源: www.ooocke.com
R9 R11 R13 R15 R17 R19 R21 R23-R31 = Res: 0603贴片电阻; BOM名称: 贴片电阻; 版权归属: 源创客; 学习资源: www.ooocke.com
U7 U8 = TLP291-4(GB-TP,E): 光耦; Manufacturer: TOSHIBA(东芝); Symbol: TLP291-4(GB-TP,E(T; Add into BOM: yes; Output Type: 光电三极管; Voltage - Forward(Vf): 1.2V; Output Current: 50mA; Isolation Voltage(Vrms): 2.5kV; Reverse Voltage: 5V; Load Voltage: 80V; Number of Outputs: 4; Vce Saturation(VCE(sat)): 400mV@2.4mA,8mA; Rise time: 2us; Fall time: 3us; Current Transfer Ratio (CTR) Minimum: 50%; Current Transfer Ratio (CTR) Maximum/Saturation Value: 400%; Device: TLP291-4(GB-TP,E); LCSC Part Name: DC输入 隔离电压(rms):2500V; Supplier Part: C60900; Manufacturer Part: TLP291-4(GB-TP,E); Supplier Footprint: SOP-16-4.4mm; JLCPCB Part Class: 扩展库; Datasheet: https://item.szlcsc.com/datasheet/TLP291-4(GB-TP%252CE)/61952.html; Supplier: LCSC; Convert to PCB: yes; Input voltage type: -; Operating Temperature: -55℃~+110℃
U9 = ULN2803: 达林顿驱动; Manufacturer: Siproin(上海矽朋); Symbol: ULN2803_C2758014; Add into BOM: yes; number of channels: 八路; Collector - Emitter Voltage VCEO: 50V; Current - Collector(Ic): 500mA; Voltage - Input(Max): 30V; Input Current(off): 65uA; Voltage - Forward(Vf): 1.7V; Reverse Leakage Current (Ir): 100uA; Input Capacitiance(Ci): 15pF; Device: ULN2803; LCSC Part Name: 高压大电流达林顿晶体管阵列; Supplier Part: C2758014; Manufacturer Part: ULN2803; Supplier Footprint: SOP-18-300mil; JLCPCB Part Class: 扩展库; Datasheet: https://item.szlcsc.com/datasheet/ULN2803/2875179.html; Supplier: LCSC; Convert to PCB: yes; Operating Temperature: -20℃~+70℃

## Sheet 串口通信电路.SchDoc
size A4; SheetNumber: 4; SheetTotal: 6
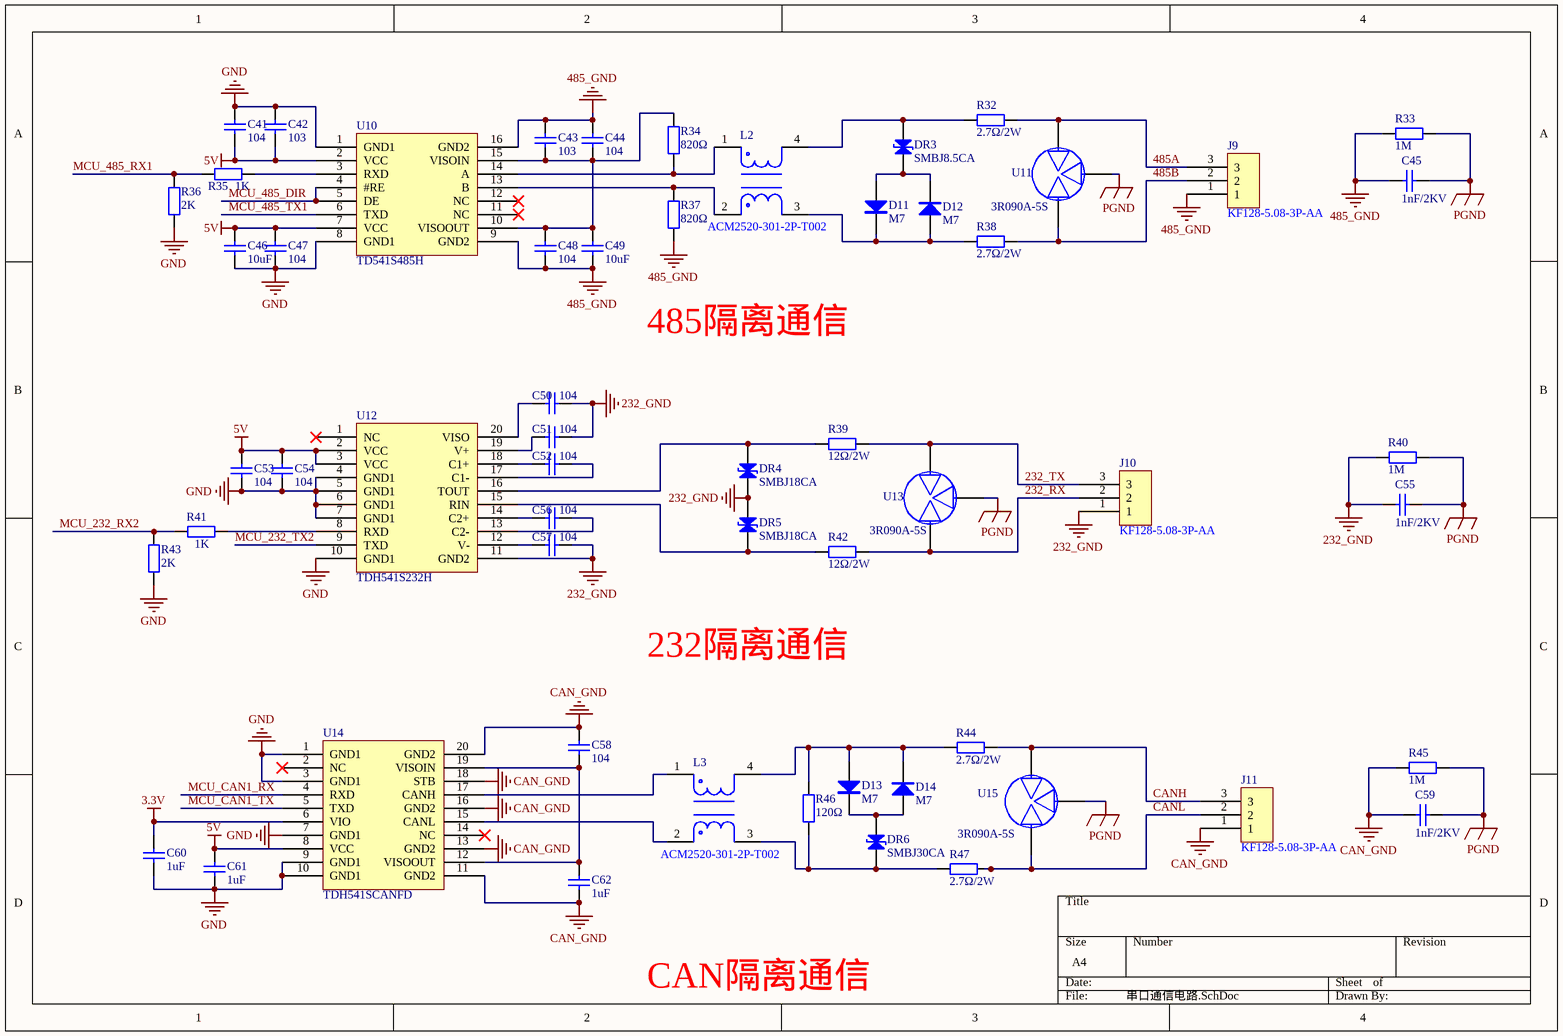
[diagram p3: 串口通信电路.SchDoc]

### Parts
C41  104  [C 0603_L]
C42  103  [C 0603_L]
C43  103  [C 0603_L]
C44  104  [C 0603_L]
C45  1nF/2KV  [C1206_L]
C46  10uF  [C 0603_L]
C47  104  [C 0603_L]
C48  104  [C 0603_L]
C49  10uF  [C 0603_L]
C50  104  [C 0603_L]
C51  104  [C 0603_L]
C52  104  [C 0603_L]
C53  104  [C 0603_L]
C54  104  [C 0603_L]
C55  1nF/2KV  [C1206_L]
C56  104  [C 0603_L]
C57  104  [C 0603_L]
C58  104  [C 0603_L]
C59  1nF/2KV  [C1206_L]
C60  1uF  [C 0603_L]
C61  1uF  [C 0603_L]
C62  1uF  [C 0603_L]
D11  M7  [SMA]
D12  M7  [SMA]
D13  M7  [SMA]
D14  M7  [SMA]
DR3  SMBJ8.5CA  [SMB]
DR4  SMBJ18CA  [SMB]
DR5  SMBJ18CA  [SMB]
DR6  SMBJ30CA  [SMB]
J9  KF128-5.08-3P-AA  [KF128-5.08-3P]
J10  KF128-5.08-3P-AA  [KF128-5.08-3P]
J11  KF128-5.08-3P-AA  [KF128-5.08-3P]
L2  ACM2520-301-2P-T002  [FILTER-SMD_4P-L2.5-W2.0-BL]
L3  ACM2520-301-2P-T002  [FILTER-SMD_4P-L2.5-W2.0-BL]
R32  2.7Ω/2W  [R2512_L]
R33  1M  [R1206_L]
R34  820Ω  [R 0603_L]
R35  1K  [R 0603_L]
R36  2K  [R 0603_L]
R37  820Ω  [R 0603_L]
R38  2.7Ω/2W  [R2512_L]
R39  12Ω/2W  [R2512_L]
R40  1M  [R1206_L]
R41  1K  [R 0603_L]
R42  12Ω/2W  [R2512_L]
R43  2K  [R 0603_L]
R44  2.7Ω/2W  [R2512_L]
R45  1M  [R1206_L]
R46  120Ω  [R 0603_L]
R47  2.7Ω/2W  [R2512_L]
U10  TD541S485H  [DFN-16_L13.0-W10.0-P1.27-BL]
U11  3R090A-5S  [DIO-DT-SMD_L7.5-W5.0]
U12  TDH541S232H  [DFN-20_L13.0-W10.0-P1.27-BL]
U13  3R090A-5S  [DIO-DT-SMD_L7.5-W5.0]
U14  TDH541SCANFD  [DFN-20_L13.0-W10.0-P1.27-BL]
U15  3R090A-5S  [DIO-DT-SMD_L7.5-W5.0]

### Nets
3.3V: C60.2 U14.6(VIO)
5V: C41.1 C42.1 C46.2 C47.2 C53.2 C54.2 C61.2 U10.2(VCC) U10.7(VCC) U12.2(VCC) U12.3(VCC) U14.8(VCC)
232_GND: C50.1 C51.1 C55.1 C57.1 DR4.2(K) DR5.1(A) J10.1 R40.1 U12.11(GND2)
485_GND: C43.2 C44.2 C45.1 C48.1 C49.1 J9.1 R33.1 R37.1 U10.9(GND2) U10.16(GND2)
CAN_GND: C58.2 C59.1 C62.1 J11.1 R45.1 U14.11(GND2) U14.13(GND2) U14.16(GND2) U14.18(STB) U14.20(GND2)
GND: C41.2 C42.2 C46.1 C47.1 C53.1 C54.1 C60.1 C61.1 R36.1 R43.1 U10.1(GND1) U10.8(GND1) U12.4(GND1) U12.5(GND1) U12.6(GND1) U12.7(GND1) U12.10(GND1) U14.1(GND1) U14.3(GND1) U14.7(GND1) U14.9(GND1) U14.10(GND1)
PGND: C45.2 C55.2 C59.2 R33.2 R40.2 R45.2 U11.2 U13.2 U15.2
232_RX: J10.2 R42.2 U13.3
232_TX: J10.3 R39.2 U13.1
485A: J9.3 R32.2 U11.1
485B: J9.2 R38.2 U11.3
CANH: J11.3 R44.2 U15.1
CANL: J11.2 R47.2 U15.3
MCU_232_RX2: R41.2 R43.2
MCU_232_TX2: U12.9(TXD)
MCU_485_DIR: U10.4(#RE) U10.5(DE)
MCU_485_RX1: R35.1 R36.2
MCU_485_TX1: U10.6(TXD)
MCU_CAN1_RX: U14.4(RXD)
MCU_CAN1_TX: U14.5(TXD)
NetC43_1: C43.1 C44.1 C48.2 C49.2 R34.2 U10.10(VISOOUT) U10.15(VISOIN)
NetC50_2: C50.2 U12.20(VISO)
NetC51_2: C51.2 U12.19(V+)
NetC52_1: C52.1 U12.17(C1-)
NetC52_2: C52.2 U12.18(C1+)
NetC56_1: C56.1 U12.13(C2-)
NetC56_2: C56.2 U12.14(C2+)
NetC57_2: C57.2 U12.12(V-)
NetC58_1: C58.1 C62.2 U14.12(VISOOUT) U14.19(VISOIN)
NetD11_1: D11.1(A) D12.2(K) DR3.2(K)
NetD11_2: D11.2(K) D12.1(A) L2.3 R38.1
NetD13_1: D13.1(A) D14.2(K) L3.4 R44.1 R46.1
NetD13_2: D13.2(K) D14.1(A) DR6.2(K)
NetDR3_1: DR3.1(A) L2.4 R32.1
NetDR4_1: DR4.1(A) R39.1 U12.16(TOUT)
NetDR5_2: DR5.2(K) R42.1 U12.15(RIN)
NetDR6_1: DR6.1(A) L3.3 R46.2 R47.1
NetL2_1: L2.1 R34.1 U10.14(A)
NetL2_2: L2.2 R37.2 U10.13(B)
NetL3_1: L3.1 U14.17(CANH)
NetL3_2: L3.2 U14.15(CANL)
NetR35_2: R35.2 U10.3(RXD)
NetR41_1: R41.1 U12.8(RXD)

Not connected (* = marked no-connect by the designer): U10 11(NC)* 12(NC)*; U12 1(NC)*; U14 2(NC)* 14(NC)*

### Notes on the sheet
- 485隔离通信
- 232隔离通信
- CAN隔离通信

### Library data of the parts
C41-C62 = Cap: 0603贴片电容; Published: 8-Jun-2000; LatestRevisionDate: 17-Jul-2002; LatestRevisionNote: Re-released for DXP Platform.; PackageReference: RAD-0.3; Publisher: Altium Limited; PackageDescription: Radial Cap, Thru-Hole; 2 Leads; 0.3 in Pin Spacing
D11-D14 = M7: as D3 on sheet 光耦开关量输入输出; BOM名称: 整流二极管; 联系售后，技术支持: https://shop463601444.taobao.com
DR3-DR6 = TVS: SMB,瞬态抑制二极管; BOM名称: 瞬态电压抑制二极管; 版权归属: 源创客; 学习资源: www.ooocke.com
J9-J11 = KF128-5.08-3P-AA: as J1 on sheet 光耦开关量输入输出; Symbol: KF128-5.08-3P; Device: KF128-5.08-3P-AA; LCSC Part Name: 5.08mm 1x3P 排数:1 每排P数:3 直插; Supplier Part: C474953; Manufacturer Part: KF128-5.08-3P-AA; Supplier Footprint: 插件,P=5.08mm; JLCPCB Part Class: 扩展库; Datasheet: https://atta.szlcsc.com/upload/public/pdf/source/20230317/DADFED05827EAD48C1D5B8C3D4CF88F4.pdf; Supplier: LCSC; Convert to PCB: yes; Color: 绿色; Mounting Style: 直插; Number of Pins: 3P; Number of Rows: 1; Operating Temperature Range: -40℃~+105℃
L2 L3 = ACM2520-301-2P-T002: 共模电感; Manufacturer: TDK; Add into BOM: yes; Number of Lines: 2; Current Rating: 400mA; Impedance @ Frequency: 300Ω@100MHz; Voltage Rating - DC: 20V; DC Resistance(DCR): 350mΩ; Insulation Resistance(IR): 10MΩ; Symbol: ACM2520-301-2P-T002; Device: ACM2520-301-2P-T002; LCSC Part Name: 两路 2520共模滤波器 阻抗300Ω@100MHz; Supplier Part: C76577; Manufacturer Part: ACM2520-301-2P-T002; Supplier Footprint: SMD-4P,2.5x2mm; JLCPCB Part Class: 扩展库; Datasheet: https://item.szlcsc.com/datasheet/ACM2520-301-2P-T002/77704.html; Supplier: LCSC; Convert to PCB: yes; Operating Temperature: -40℃~+85℃
R32-R47 = Res: 0603贴片电阻; BOM名称: 贴片电阻; 版权归属: 源创客; 学习资源: www.ooocke.com
U10 = TD541S485H: 金升阳485隔离芯片（带隔离电源）; Manufacturer: MORNSUN(金升阳); Add into BOM: yes; Symbol: TD541S485H; Device: TD541S485H; LCSC Part Name: 3.3V或5.5V供电 1Mbps 带静电保护收发器; Supplier Part: C707458; Manufacturer Part: TD541S485H; Supplier Footprint: DFN-16(10x13); JLCPCB Part Class: 扩展库; Datasheet: https://item.szlcsc.com/datasheet/TD541S485H/745222.html; Supplier: LCSC; Convert to PCB: yes
U11 U13 U15 = 3R090A-5S_C48642393: 气体放电管; Manufacturer: R+O(宏嘉诚); Add into BOM: yes; Number of Poles: 3; Voltage - DC Spark Over (Nom): 90V; Tolerance: ±20%; Impulse Discharge Current: 5kA; inter-electrode capacitance: 1.5pF; Impulse Breakdown Voltage(Vimp): 600V; Symbol: 3R090A-5S; Device: 3R090A-5S_C48642393; LCSC Part Name: 90V 5kA 3; Supplier Part: C48642393; Manufacturer Part: 3R090A-5S; Supplier Footprint: SMD-3P,7.5x5mm; JLCPCB Part Class: 扩展库; Datasheet: https://item.szlcsc.com/datasheet/3R090A-5S/50921357.html; Supplier: LCSC; Convert to PCB: yes; Operating Temperature Range: -40℃~+85℃; Diameter (φD): 7.5mm
U12 = TDH541S232H: 金升阳232隔离芯片（带隔离电源）; Manufacturer: MORNSUN(金升阳); Add into BOM: yes; Isolation Voltage(Vrms): 5000; CMTI(kV/us): 25kV/us; Voltage - Supply: 4.5V~5.5V; Symbol: TDH541S232H; Device: TDH541S232H; LCSC Part Name: TDH541S232H; Supplier Part: C5116474; Manufacturer Part: TDH541S232H; Supplier Footprint: DFN-20(10x13); JLCPCB Part Class: 扩展库; Datasheet: https://item.szlcsc.com/datasheet/TDH541S232H/5692546.html; Supplier: LCSC; Convert to PCB: yes; Operating Temperature: -40℃~+85℃
U14 = TDH541SCANFD: 金升阳CAN芯片（带隔离电源）; Manufacturer: MORNSUN(金升阳); Add into BOM: yes; Symbol: TDH541SCANFD; Device: TDH541SCANFD; LCSC Part Name: TDH541SCANFD 停产; Supplier Part: C4355532; Manufacturer Part: TDH541SCANFD; Supplier Footprint: DFN-20(10x13); JLCPCB Part Class: 扩展库; Datasheet: https://item.szlcsc.com/datasheet/TDH541SCANFD/4926205.html; Supplier: LCSC; Convert to PCB: yes

## Sheet 模拟量输入输出电路.SchDoc
size A4; SheetNumber: 5; SheetTotal: 7
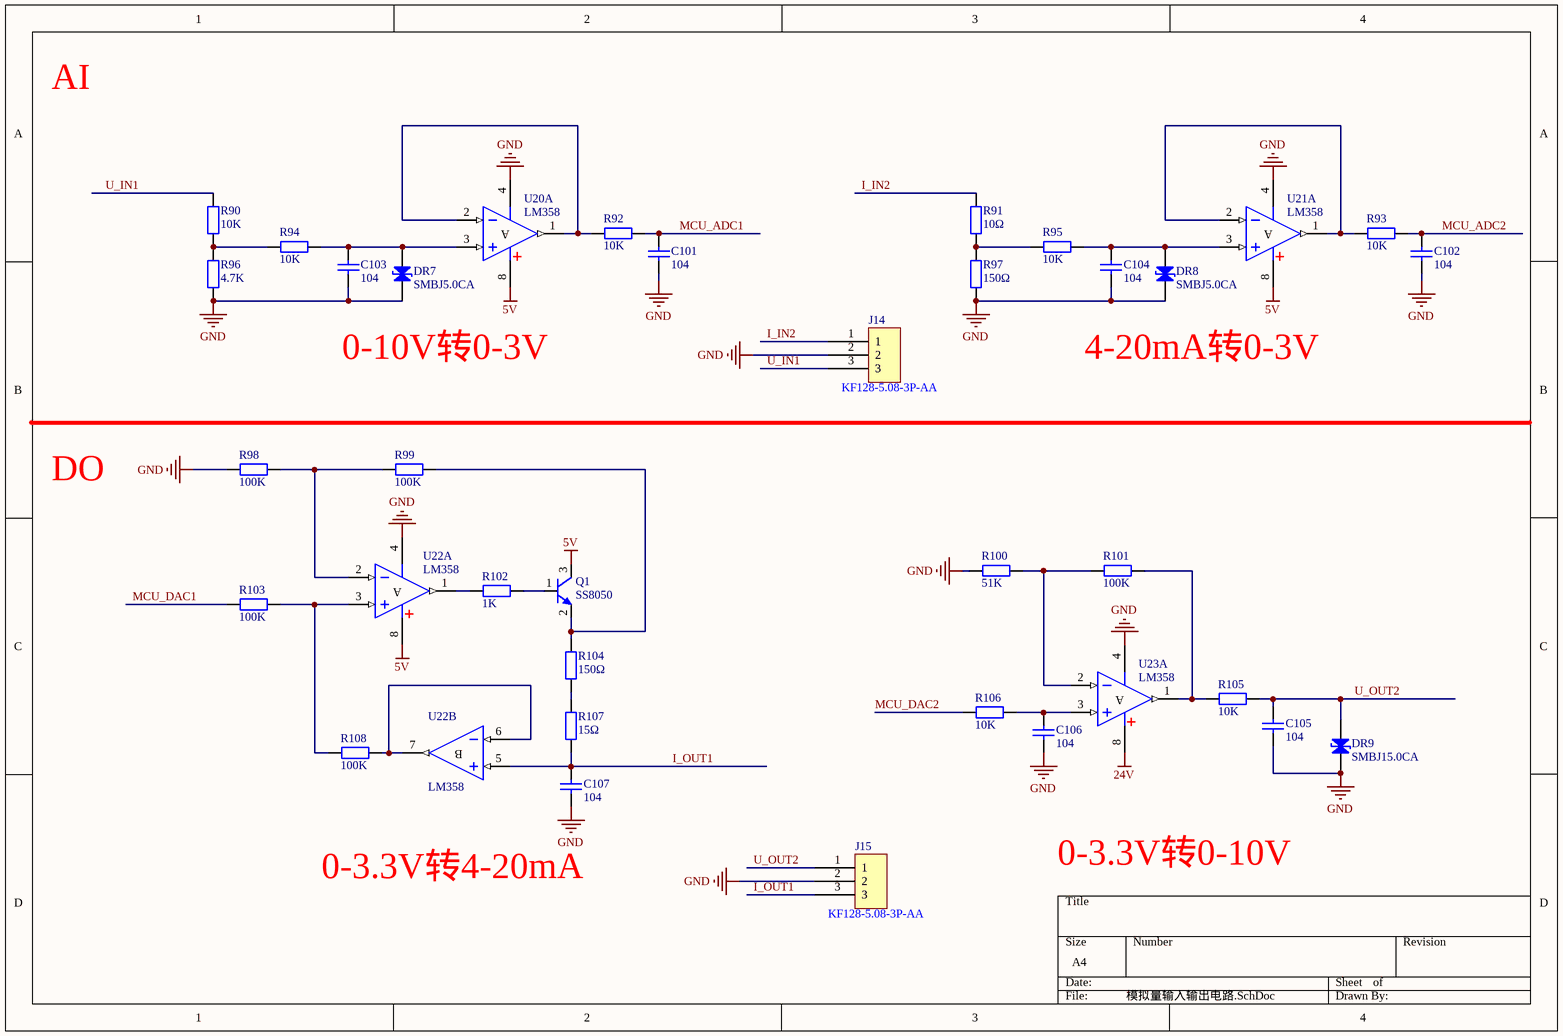
[diagram p4: 模拟量输入输出电路.SchDoc]

### Parts
C101  104  [C 0603_L]
C102  104  [C 0603_L]
C103  104  [C 0603_L]
C104  104  [C 0603_L]
C105  104  [C 0603_L]
C106  104  [C 0603_L]
C107  104  [C 0603_L]
DR7  SMBJ5.0CA  [SMB]
DR8  SMBJ5.0CA  [SMB]
DR9  SMBJ15.0CA  [SMB]
J14  KF128-5.08-3P-AA  [KF128-5.08-3P]
J15  KF128-5.08-3P-AA  [KF128-5.08-3P]
Q1  SS8050  [SOT-23_S8050]
R90  10K  [R 0603_L]
R91  10Ω  [R 0603_L]
R92  10K  [R 0603_L]
R93  10K  [R 0603_L]
R94  10K  [R 0603_L]
R95  10K  [R 0603_L]
R96  4.7K  [R 0603_L]
R97  150Ω  [R 0603_L]
R98  100K  [R 0603_L]
R99  100K  [R 0603_L]
R100  51K  [R 0603_L]
R101  100K  [R 0603_L]
R102  1K  [R 0603_L]
R103  100K  [R 0603_L]
R104  150Ω  [R 0603_L]
R105  10K  [R 0603_L]
R106  10K  [R 0603_L]
R107  15Ω  [R 0603_L]
R108  100K  [R 0603_L]
U20  LM358  [SOP8]  (part A of 2)
U21  LM358  [SOP8]  (part A of 2)
U22  LM358  [SOP8]  (parts A,B of 2)
U23  LM358  [SOP8]  (part A of 2)

### Nets
5V: Q1.3(C) U20.8(V+) U21.8(V+) U22.8(V+)
24V: U23.8(V+)
GND: C101.1 C102.1 C103.1 C104.1 C105.1 C106.1 C107.1 DR7.2(K) DR8.2(K) DR9.2(K) J14.2 J15.2 R96.1 R97.1 R98.2 R100.2 U20.4(V-) U21.4(V-) U22.4(V-) U23.4(V-)
I_IN2: J14.1 R91.2
I_OUT1: C107.2 J15.3 R107.2 U22.5(IN+)
MCU_ADC1: C101.2 R92.1
MCU_ADC2: C102.2 R93.1
MCU_DAC1: R103.2
MCU_DAC2: R106.2
U_IN1: J14.3 R90.2
U_OUT2: C105.2 DR9.1(A) J15.1 R105.1
NetC103_2: C103.2 DR7.1(A) R94.1 U20.3(IN+)
NetC104_2: C104.2 DR8.1(A) R95.1 U21.3(IN+)
NetC106_2: C106.2 R106.1 U23.3(IN+)
NetQ1_1: Q1.1(B) R102.1
NetQ1_2: Q1.2(E) R99.1 R104.1
NetR90_1: R90.1 R94.2 R96.2
NetR91_1: R91.1 R95.2 R97.2
NetR92_2: R92.2 U20.1(OUT) U20.2(IN-)
NetR93_2: R93.2 U21.1(OUT) U21.2(IN-)
NetR98_1: R98.1 R99.2 U22.2(IN-)
NetR100_1: R100.1 R101.2 U23.2(IN-)
NetR101_1: R101.1 R105.2 U23.1(OUT)
NetR102_2: R102.2 U22.1(OUT)
NetR103_1: R103.1 R108.2 U22.3(IN+)
NetR104_2: R104.2 R107.1
NetR108_1: R108.1 U22.6(IN-) U22.7(OUT)

### Notes on the sheet
- AI
- 0-10V转0-3V
- 4-20mA转0-3V
- DO
- 0-3.3V转4-20mA
- 0-3.3V转0-10V
- (in symbol LM358, part A) A
- (in symbol LM358, part B) B

### Library data of the parts
C101-C107 = Cap: 0603贴片电容; Published: 8-Jun-2000; LatestRevisionDate: 17-Jul-2002; LatestRevisionNote: Re-released for DXP Platform.; PackageReference: RAD-0.3; Publisher: Altium Limited; PackageDescription: Radial Cap, Thru-Hole; 2 Leads; 0.3 in Pin Spacing
DR7-DR9 = TVS: SMA，瞬态电压抑制二极管; 版权归属: 源创客; BOM名称: 瞬态电压抑制二极管; 学习资源: www.ooocke.com
J14 J15 = KF128-5.08-3P-AA: as J1 on sheet 光耦开关量输入输出; Symbol: KF128-5.08-3P; Device: KF128-5.08-3P-AA; LCSC Part Name: 5.08mm 1x3P 排数:1 每排P数:3 直插; Supplier Part: C474953; Manufacturer Part: KF128-5.08-3P-AA; Supplier Footprint: 插件,P=5.08mm; JLCPCB Part Class: 扩展库; Datasheet: https://atta.szlcsc.com/upload/public/pdf/source/20230317/DADFED05827EAD48C1D5B8C3D4CF88F4.pdf; Supplier: LCSC; Convert to PCB: yes; Color: 绿色; Mounting Style: 直插; Number of Pins: 3P; Number of Rows: 1; Operating Temperature Range: -40℃~+105℃
Q1 = S8050: NPN三极管; BOM名称: 高频放大-NPN型; 版权归属: 源创客; 属性: 40V 1.5A 1W 100MHZ; 学习资源: www.ooocke.com
R90-R103 R105 R106 R108 = Res: C0603贴片电阻; BOM名称: 贴片电阻; 版权归属: 源创客; 学习资源: www.ooocke.com
R104 R107 = Res: 0603贴片电阻; BOM名称: 贴片电阻; 版权归属: 源创客; 学习资源: www.ooocke.com
U20-U23 = LM358: 双路运放; 版权归属: 源创客; BOM名称: 双路运放; 学习资源: www.ooocke.com

## Sheet 模拟量采集电路.SchDoc
size A4; SheetNumber: 6; SheetTotal: 6
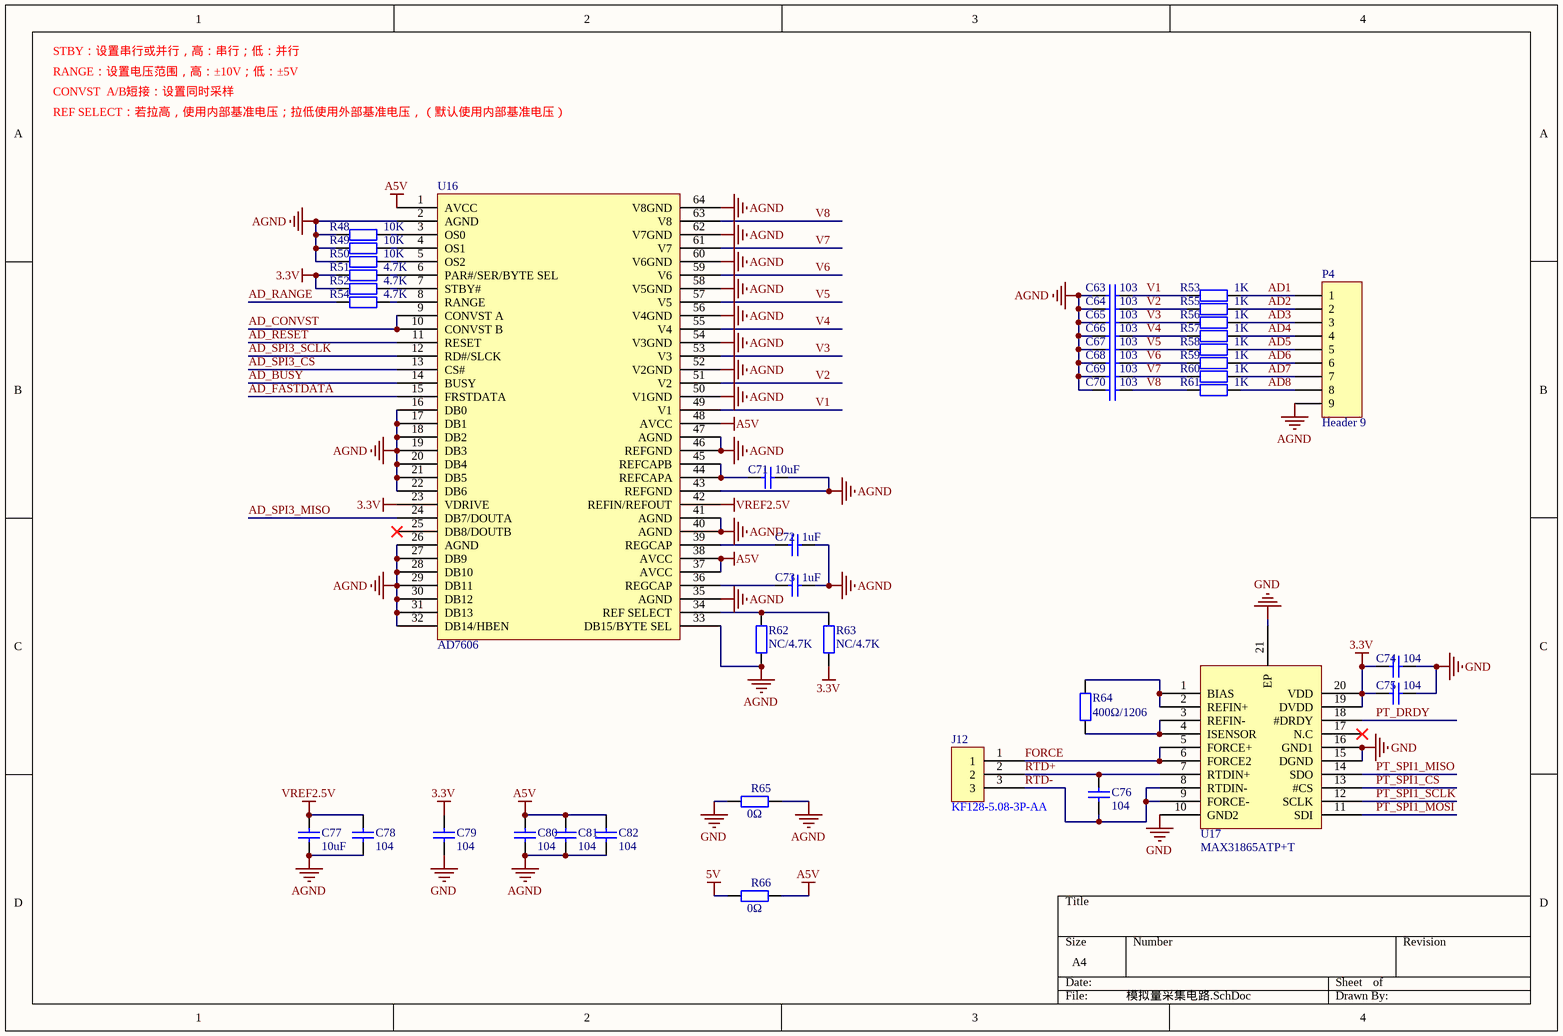
[diagram p5: 模拟量采集电路.SchDoc]

### Parts
C63  103  [C 0603_L]
C64  103  [C 0603_L]
C65  103  [C 0603_L]
C66  103  [C 0603_L]
C67  103  [C 0603_L]
C68  103  [C 0603_L]
C69  103  [C 0603_L]
C70  103  [C 0603_L]
C71  10uF  [C 0603_L]
C72  1uF  [C 0603_L]
C73  1uF  [C 0603_L]
C74  104  [C 0603_L]
C75  104  [C 0603_L]
C76  104  [C 0603_L]
C77  10uF  [C 0603_L]
C78  104  [C 0603_L]
C79  104  [C 0603_L]
C80  104  [C 0603_L]
C81  104  [C 0603_L]
C82  104  [C 0603_L]
J12  KF128-5.08-3P-AA  [KF128-5.08-3P]
P4  Header 9  [KF128-5.08-9P]
R48  10K  [R 0603_L]
R49  10K  [R 0603_L]
R50  10K  [R 0603_L]
R51  4.7K  [R 0603_L]
R52  4.7K  [R 0603_L]
R53  1K  [R 0603_L]
R54  4.7K  [R 0603_L]
R55  1K  [R 0603_L]
R56  1K  [R 0603_L]
R57  1K  [R 0603_L]
R58  1K  [R 0603_L]
R59  1K  [R 0603_L]
R60  1K  [R 0603_L]
R61  1K  [R 0603_L]
R62  NC/4.7K  [R 0603_L]
R63  NC/4.7K  [R 0603_L]
R64  400Ω/1206  [R1206_L]
R65  0Ω  [R 0603_L]
R66  0Ω  [R 0603_L]
U16  AD7606  [LQFP64 10x10_M]
U17  MAX31865ATP+T  [QFN-20_L5.0-W5.0-P0.65-BL-EP]

### Nets
3.3V: C74.2 C75.2 C79.2 R51.2 R52.2 R63.2 U16.23(VDRIVE) U17.19(DVDD) U17.20(VDD)
5V: R66.1
A5V: C80.2 C81.2 C82.2 R66.2 U16.1(AVCC) U16.37(AVCC) U16.38(AVCC) U16.48(AVCC)
AGND: C63.2 C64.2 C65.2 C66.2 C67.2 C68.2 C69.2 C70.2 C71.1 C72.1 C73.1 C77.2 C78.1 C80.1 C81.1 C82.1 P4.9 R48.2 R49.2 R50.2 R62.2 R65.2 U16.2(AGND) U16.16(DB0) U16.17(DB1) U16.18(DB2) U16.19(DB3) U16.20(DB4) U16.21(DB5) U16.22(DB6) U16.26(AGND) U16.27(DB9) U16.28(DB10) U16.29(DB11) U16.30(DB12) U16.31(DB13) U16.32(DB14/HBEN) U16.33(DB15/BYTE_SEL) U16.35(AGND) U16.40(AGND) U16.41(AGND) U16.43(REFGND) U16.46(REFGND) U16.47(AGND) U16.50(V1GND) U16.52(V2GND) U16.54(V3GND) U16.56(V4GND) U16.58(V5GND) U16.60(V6GND) U16.62(V7GND) U16.64(V8GND)
GND: C74.1 C75.1 C79.1 R65.1 U17.10(GND2) U17.15(DGND) U17.16(GND1) U17.21(EP)
VREF2.5V: C77.1 C78.2 U16.42(REFIN/REFOUT)
AD1: P4.1 R53.1
AD2: P4.2 R55.1
AD3: P4.3 R56.1
AD4: P4.4 R57.1
AD5: P4.5 R58.1
AD6: P4.6 R59.1
AD7: P4.7 R60.1
AD8: P4.8 R61.1
AD_BUSY: U16.14(BUSY)
AD_CONVST: U16.9(CONVST_A) U16.10(CONVST_B)
AD_FASTDATA: U16.15(FRSTDATA)
AD_RANGE: R54.2
AD_RESET: U16.11(RESET)
AD_SPI3_CS: U16.13(CS#)
AD_SPI3_MISO: U16.24(DB7/DOUTA)
AD_SPI3_SCLK: U16.12(RD#/SLCK)
FORCE: J12.1 U17.5(FORCE+) U17.6(FORCE2)
PT_DRDY: U17.18(#DRDY)
PT_SPI1_CS: U17.13(#CS)
PT_SPI1_MISO: U17.14(SDO)
PT_SPI1_MOSI: U17.11(SDI)
PT_SPI1_SCLK: U17.12(SCLK)
RTD+: C76.2 J12.2 U17.7(RTDIN+)
RTD-: C76.1 J12.3 U17.8(RTDIN-) U17.9(FORCE-)
V1: C63.1 R53.2 U16.49(V1)
V2: C64.1 R55.2 U16.51(V2)
V3: C65.1 R56.2 U16.53(V3)
V4: C66.1 R57.2 U16.55(V4)
V5: C67.1 R58.2 U16.57(V5)
V6: C68.1 R59.2 U16.59(V6)
V7: C69.1 R60.2 U16.61(V7)
V8: C70.1 R61.2 U16.63(V8)
NetC71_2: C71.2 U16.44(REFCAPA) U16.45(REFCAPB)
NetC72_2: C72.2 U16.39(REGCAP)
NetC73_2: C73.2 U16.36(REGCAP)
NetR48_1: R48.1 U16.3(OS0)
NetR49_1: R49.1 U16.4(OS1)
NetR50_1: R50.1 U16.5(OS2)
NetR51_1: R51.1 U16.6(PAR#/SER/BYTE_SEL)
NetR52_1: R52.1 U16.7(STBY#)
NetR54_1: R54.1 U16.8(RANGE)
NetR62_1: R62.1 R63.1 U16.34(REF_SELECT)
NetR64_1: R64.1 U17.1(BIAS) U17.2(REFIN+)
NetR64_2: R64.2 U17.3(REFIN-) U17.4(ISENSOR)

Not connected (* = marked no-connect by the designer): U16 25(DB8/DOUTB)*; U17 17(N.C)*

### Notes on the sheet
- STBY：设置串行或并行，高：串行；低：并行
- RANGE：设置电压范围，高：±10V；低：±5V
- CONVST  A/B短接：设置同时采样
- REF SELECT：若拉高，使用内部基准电压；拉低使用外部基准电压，（默认使用内部基准电压）

### Library data of the parts
C63-C82 = Cap: 0603贴片电容; Published: 8-Jun-2000; LatestRevisionDate: 17-Jul-2002; LatestRevisionNote: Re-released for DXP Platform.; PackageReference: RAD-0.3; Publisher: Altium Limited; PackageDescription: Radial Cap, Thru-Hole; 2 Leads; 0.3 in Pin Spacing
J12 = KF128-5.08-3P-AA: as J1 on sheet 光耦开关量输入输出; Symbol: KF128-5.08-3P; Device: KF128-5.08-3P-AA; LCSC Part Name: 5.08mm 1x3P 排数:1 每排P数:3 直插; Supplier Part: C474953; Manufacturer Part: KF128-5.08-3P-AA; Supplier Footprint: 插件,P=5.08mm; JLCPCB Part Class: 扩展库; Datasheet: https://atta.szlcsc.com/upload/public/pdf/source/20230317/DADFED05827EAD48C1D5B8C3D4CF88F4.pdf; Supplier: LCSC; Convert to PCB: yes; Color: 绿色; Mounting Style: 直插; Number of Pins: 3P; Number of Rows: 1; Operating Temperature Range: -40℃~+105℃
P4 = Header 9: Header, 9-Pin; LatestRevisionDate: 17-Jul-2002; LatestRevisionNote: Re-released for DXP Platform.; Publisher: Altium Limited
R48-R66 = Res: 0603贴片电阻; BOM名称: 贴片电阻; 版权归属: 源创客; 学习资源: www.ooocke.com
U16 = AD7606: Add into BOM: yes; Symbol: AD7606; Device: AD7606; LCSC Part Name: AD7606; Supplier Part: C9900008332; Manufacturer Part: AD7606; Supplier Footprint: LQFP-64(10x10); JLCPCB Part Class: 扩展库; Supplier: LCSC; Convert to PCB: yes
U17 = MAX31865ATP+T: Manufacturer: ADI(亚德诺)/MAXIM(美信); Add into BOM: yes; Resolution(Bits): 15位; number of channels: 1; Voltage - Supply: 3V~3.6V; Interface: SPI; differential input: 是; Integral non - linearity: 1LSB; Clock Frequency: 5MHz; ADC architecture: Sigma-Delta; Quiescent Current (Iq): 1.5mA; Symbol: MAX31865ATP+T; Device: MAX31865ATP+T; LCSC Part Name: MAX31865ATP; Supplier Part: C118474; Manufacturer Part: MAX31865ATP+T; Supplier Footprint: QFN-20-EP(5x5); Datasheet: https://item.szlcsc.com/datasheet/MAX31865ATP%252BT/119740.html; Supplier: LCSC; Convert to PCB: yes; Sampling Rate: -; Operating Temperature: -40℃~+125℃

## Sheet 网络通信电路.SchDoc
size A4; SheetNumber: 7; SheetTotal: 7
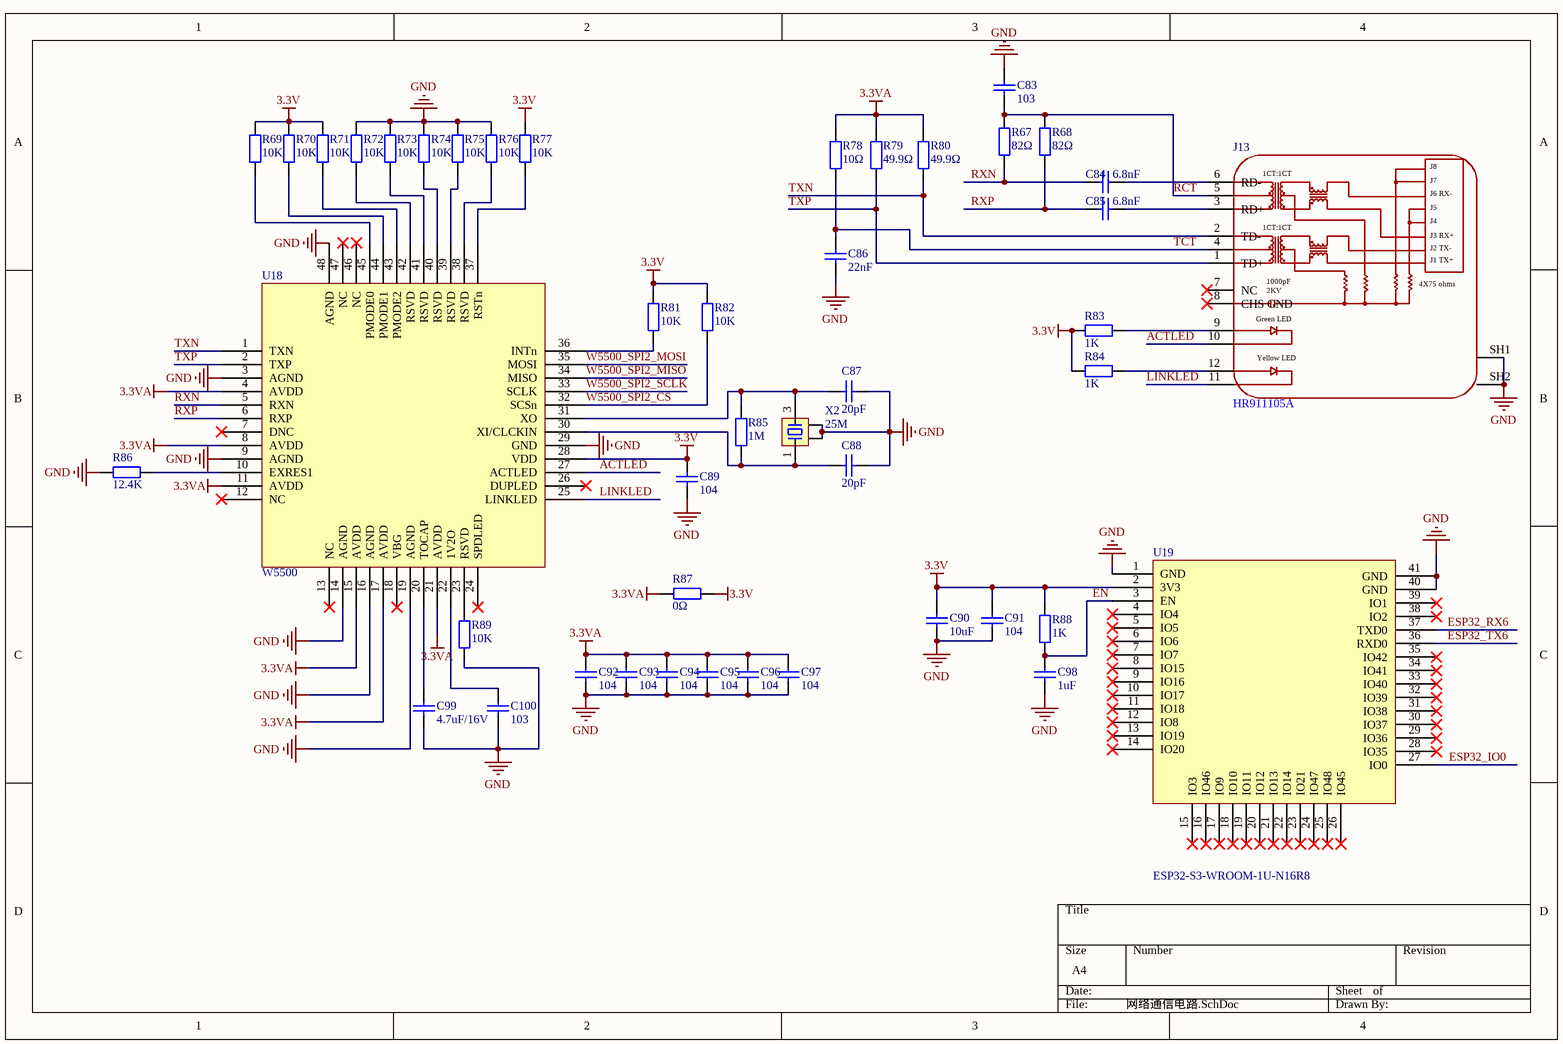
[diagram p6: 网络通信电路.SchDoc]

### Parts
C83  103  [C 0603_L]
C84  6.8nF  [C 0603_L]
C85  6.8nF  [C 0603_L]
C86  22nF  [C 0603_L]
C87  20pF  [C 0603_L]
C88  20pF  [C 0603_L]
C89  104  [C 0603_L]
C90  10uF  [C 0603_L]
C91  104  [C 0603_L]
C92  104  [C 0603_L]
C93  104  [C 0603_L]
C94  104  [C 0603_L]
C95  104  [C 0603_L]
C96  104  [C 0603_L]
C97  104  [C 0603_L]
C98  1uF  [C 0603_L]
C99  4.7uF/16V  [C 0603_L]
C100  103  [C 0603_L]
J13  HR911105A  [RJ45-TH_HR911105A]
R67  82Ω  [R 0603_L]
R68  82Ω  [R 0603_L]
R69  10K  [R 0603_L]
R70  10K  [R 0603_L]
R71  10K  [R 0603_L]
R72  10K  [R 0603_L]
R73  10K  [R 0603_L]
R74  10K  [R 0603_L]
R75  10K  [R 0603_L]
R76  10K  [R 0603_L]
R77  10K  [R 0603_L]
R78  10Ω  [R 0603_L]
R79  49.9Ω  [R 0603_L]
R80  49.9Ω  [R 0603_L]
R81  10K  [R 0603_L]
R82  10K  [R 0603_L]
R83  1K  [R 0603_L]
R84  1K  [R 0603_L]
R85  1M  [R 0603_L]
R86  12.4K  [R 0603_L]
R87  0Ω  [R 0603_L]
R88  1K  [R 0603_L]
R89  10K  [R 0603_L]
U18  W5500  [LQFP48 7X7_L]
U19  ESP32-S3-WROOM-1U-N16R8  [WIRELM-SMD_ESP32-S3-WROOM-1U]
X2  25M  [OSC 3225-4P]

### Nets
3.3V: C89.2 C90.2 C91.2 R69.2 R70.2 R71.2 R77.2 R81.2 R82.2 R83.2 R84.2 R87.2 R88.1 U18.28(VDD) U19.2(3V3)
3.3VA: C92.2 C93.2 C94.2 C95.2 C96.2 C97.2 R78.1 R79.1 R80.1 R87.1 U18.4(AVDD) U18.8(AVDD) U18.11(AVDD) U18.15(AVDD) U18.17(AVDD) U18.21(AVDD)
GND: C83.2 C86.2 C87.1 C88.1 C89.1 C90.1 C91.1 C92.1 C93.1 C94.1 C95.1 C96.1 C97.1 C98.1 C99.1 C100.1 J13.SH1 J13.SH2 R72.2 R73.2 R74.2 R75.2 R76.2 R86.1 R89.1 U18.3(AGND) U18.9(AGND) U18.14(AGND) U18.16(AGND) U18.19(AGND) U18.29(GND) U18.48(AGND) U19.1(GND) U19.40(GND) U19.41(GND) X2.2 X2.4
ACTLED: J13.10 U18.27(ACTLED)
EN: C98.2 R88.2 U19.3(EN)
ESP32_IO0: U19.27(IO0)
ESP32_RX6: U19.37(TXD0)
ESP32_TX6: U19.36(RXD0)
LINKLED: J13.11 U18.25(LINKLED)
RCT: C83.1 J13.5 R67.1 R68.1
RXN: C84.1 R67.2 U18.5(RXN)
RXP: C85.1 R68.2 U18.6(RXP)
TCT: C86.1 J13.4 R78.2
TXN: J13.2(TD-) R80.2 U18.1(TXN)
TXP: J13.1(TD+) R79.2 U18.2(TXP)
W5500_SPI2_CS: R82.1 U18.32(SCSn)
W5500_SPI2_MISO: U18.34(MISO)
W5500_SPI2_MOSI: U18.35(MOSI)
W5500_SPI2_SCLK: U18.33(SCLK)
NetC84_2: C84.2 J13.6(RD-)
NetC85_2: C85.2 J13.3(RD+)
NetC87_2: C87.2 R85.2 U18.31(XO) X2.3
NetC88_2: C88.2 R85.1 U18.30(XI/CLCKIN) X2.1
NetC99_2: C99.2 U18.20(TOCAP)
NetC100_2: C100.2 U18.22(1V2O)
NetJ13_9: J13.9 R83.1
NetJ13_12: J13.12 R84.1
NetR69_1: R69.1 U18.45(PMODE0)
NetR70_1: R70.1 U18.44(PMODE1)
NetR71_1: R71.1 U18.43(PMODE2)
NetR72_1: R72.1 U18.42(RSVD)
NetR73_1: R73.1 U18.41(RSVD)
NetR74_1: R74.1 U18.40(RSVD)
NetR75_1: R75.1 U18.39(RSVD)
NetR76_1: R76.1 U18.38(RSVD)
NetR77_1: R77.1 U18.37(RSTn)
NetR81_1: R81.1 U18.36(INTn)
NetR86_2: R86.2 U18.10(EXRES1)
NetR89_2: R89.2 U18.23(RSVD)

Not connected (* = marked no-connect by the designer): J13 7(NC)* 8(CHS_GND)*; U18 7(DNC)* 12(NC)* 13(NC)* 18(VBG)* 24(SPDLED)* 26(DUPLED)* 46(NC)* 47(NC)*; U19 4(IO4)* 5(IO5)* 6(IO6)* 7(IO7)* 8(IO15)* 9(IO16)* 10(IO17)* 11(IO18)* 12(IO8)* 13(IO19)* 14(IO20)* 15(IO3)* 16(IO46)* 17(IO9)* 18(IO10)* 19(IO11)* 20(IO12)* 21(IO13)* 22(IO14)* 23(IO21)* 24(IO47)* 25(IO48)* 26(IO45)* 28(IO35)* 29(IO36)* 30(IO37)* 31(IO38)* 32(IO39)* 33(IO40)* 34(IO41)* 35(IO42)* 38(IO2)* 39(IO1)*

### Notes on the sheet
- (in symbol HR911105A_C12074) J8; 1CT:1CT; J7; J6 RX-; J5; J4; J3 RX+; J2 TX-; J1 TX+; 1000pF; 4X75 ohms; 2KV; Green LED; Yellow LED

### Library data of the parts
C83-C100 = Cap: 0603贴片电容; Published: 8-Jun-2000; LatestRevisionDate: 17-Jul-2002; LatestRevisionNote: Re-released for DXP Platform.; PackageReference: RAD-0.3; Publisher: Altium Limited; PackageDescription: Radial Cap, Thru-Hole; 2 Leads; 0.3 in Pin Spacing
J13 = HR911105A_C12074: 网口; Manufacturer: HANRUN(汉仁); Add into BOM: yes; Connector Type: RJ45插座; Number of Ports: 1; LED: 带LED; PoE: 不带PoE; Supplementary Features: 带滤波; Symbol: HR911105A_C12074; Device: HR911105A_C12074; LCSC Part Name: 带LED; Supplier Part: C12074; Manufacturer Part: HR911105A; Supplier Footprint: 插件; JLCPCB Part Class: 扩展库; Datasheet: https://item.szlcsc.com/datasheet/HR911105A/12651.html; Supplier: LCSC; Convert to PCB: yes; Mounting Type: -; Shielding: -; Ratings: -; Contact Material: -; Contact Plating: -; Operating Temperature: -
R67-R89 = Res: C0603贴片电阻; BOM名称: 贴片电阻; 版权归属: 源创客; 学习资源: www.ooocke.com
U18 = W5500: W5500以太网芯片
U19 = ESP32-S3-WROOM-1U-N16R8: Manufacturer: ESPRESSIF(乐鑫); Add into BOM: yes; Symbol: ESP32-S3-WROOM-1U-N16R8; Device: ESP32-S3-WROOM-1U-N16R8; LCSC Part Name: ESP32-S3-WROOM-1U-N16R8; Supplier Part: C3013946; Manufacturer Part: ESP32-S3-WROOM-1U-N16R8; Supplier Footprint: SMD,19.2x18mm; JLCPCB Part Class: 扩展库; Datasheet: https://item.szlcsc.com/datasheet/ESP32-S3-WROOM-1U-N16R8/3522416.html; Supplier: LCSC; Convert to PCB: yes
X2 = XTAL-4P: 4脚无源晶振; 版权归属: 封装库来自淘宝卖家 ID：黄晶宝石; BOM名称: 4脚无源晶振; 学习资源: https://shop463601444.taobao.com

## Sheet 网表.SchDoc
size A4; SheetNumber: 8; SheetTotal: 8
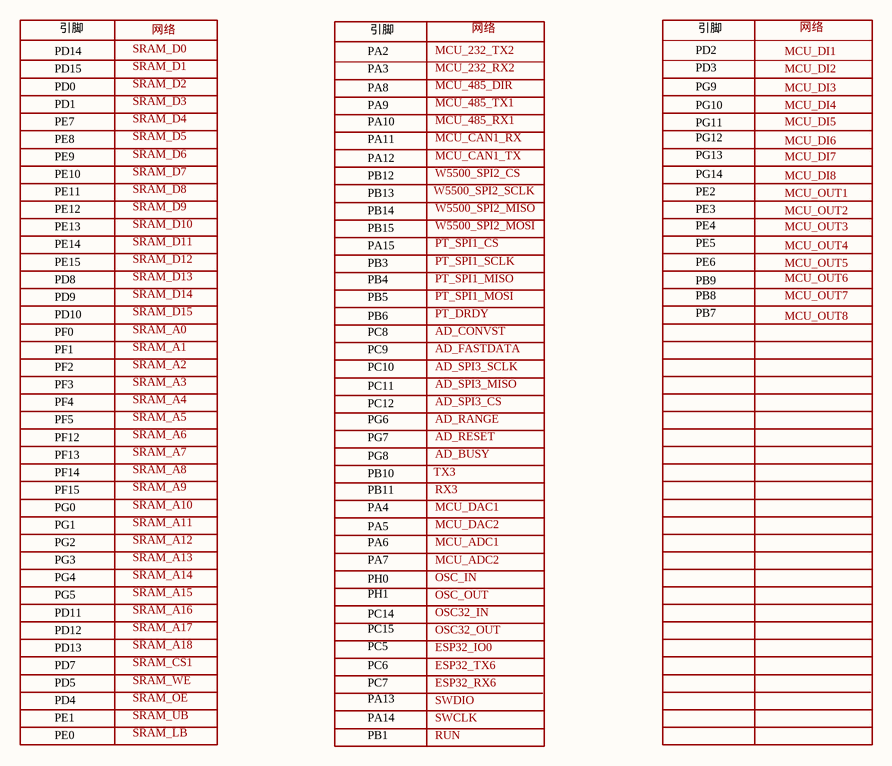
[diagram p7: 网表.SchDoc]

### Notes on the sheet
- 引脚
- 网络
- PD14
- PD15
- PD0
- PD1
- SRAM_D0
- SRAM_D1
- SRAM_D2
- SRAM_D3
- PA2
- PA3
- PA8
- PA9
- MCU_232_TX2
- MCU_232_RX2
- MCU_485_DIR
- MCU_485_TX1
- PD2
- PD3
- PG9
- PG10
- MCU_DI1
- MCU_DI2
- MCU_DI3
- MCU_DI4
- PE7
- PE8
- PE9
- PE10
- SRAM_D4
- SRAM_D5
- SRAM_D6
- SRAM_D7
- PA10
- PA11
- PA12
- PB12
- MCU_485_RX1
- MCU_CAN1_RX
- MCU_CAN1_TX
- W5500_SPI2_CS
- PG11
- PG12
- PG13
- PG14
- MCU_DI5
- MCU_DI6
- MCU_DI7
- MCU_DI8
- PE11
- PE12
- PE13
- PE14
- SRAM_D8
- SRAM_D9
- SRAM_D10
- SRAM_D11
- PB13
- PB14
- PB15
- PA15
- W5500_SPI2_SCLK
- W5500_SPI2_MISO
- W5500_SPI2_MOSI
- PT_SPI1_CS
- PE2
- PE3
- PE4
- PE5
- MCU_OUT1
- MCU_OUT2
- MCU_OUT3
- MCU_OUT4
- PE15
- PD8
- PD9
- PD10
- SRAM_D12
- SRAM_D13
- SRAM_D14
- SRAM_D15
- PB3
- PB4
- PB5
- PT_SPI1_SCLK
- PT_SPI1_MISO
- PT_SPI1_MOSI
- PT_DRDY
- PE6
- PB9
- PB8
- PB7
- MCU_OUT5
- MCU_OUT6
- MCU_OUT7
- PF0
- PF1
- PF2
- SRAM_A0
- SRAM_A1
- SRAM_A2
- PB6
- PC8
- PC9
- PC10
- AD_SPI3_SCLK
- AD_CONVST
- AD_FASTDATA
- MCU_OUT8
- PF3
- PF4
- PF5
- PF12
- SRAM_A3
- SRAM_A4
- SRAM_A5
- SRAM_A6
- PC11
- PC12
- PG6
- PG7
- AD_SPI3_MISO
- AD_SPI3_CS
- AD_RANGE
- AD_RESET
- PG0
- PF13
- PF14
- PF15
- SRAM_A7
- SRAM_A8
- SRAM_A9
- SRAM_A10
- PG8
- PB10
- PB11
- PA4
- TX3
- AD_BUSY
- RX3
- MCU_DAC1
- PG1
- PG2
- PG3
- PG4
- SRAM_A11
- SRAM_A12
- SRAM_A13
- SRAM_A14
- PA5
- PA6
- PA7
- PH0
- MCU_DAC2
- MCU_ADC1
- MCU_ADC2
- OSC_IN
- PG5
- PD11
- PD12
- PD13
- SRAM_A15
- SRAM_A16
- SRAM_A17
- SRAM_A18
- PH1
- PC14
- PC15
- PC5
- OSC_OUT
- OSC32_IN
- OSC32_OUT
- ESP32_IO0
- PE1
- PD4
- PD5
- PD7
- SRAM_CS1
- SRAM_WE
- SRAM_OE
- SRAM_UB
- PC6
- PC7
- PA13
- PA14
- ESP32_TX6
- ESP32_RX6
- SWDIO
- SWCLK
- PE0
- SRAM_LB
- PB1
- RUN